# Altium project H2_transmitter_v2.PrjPcb
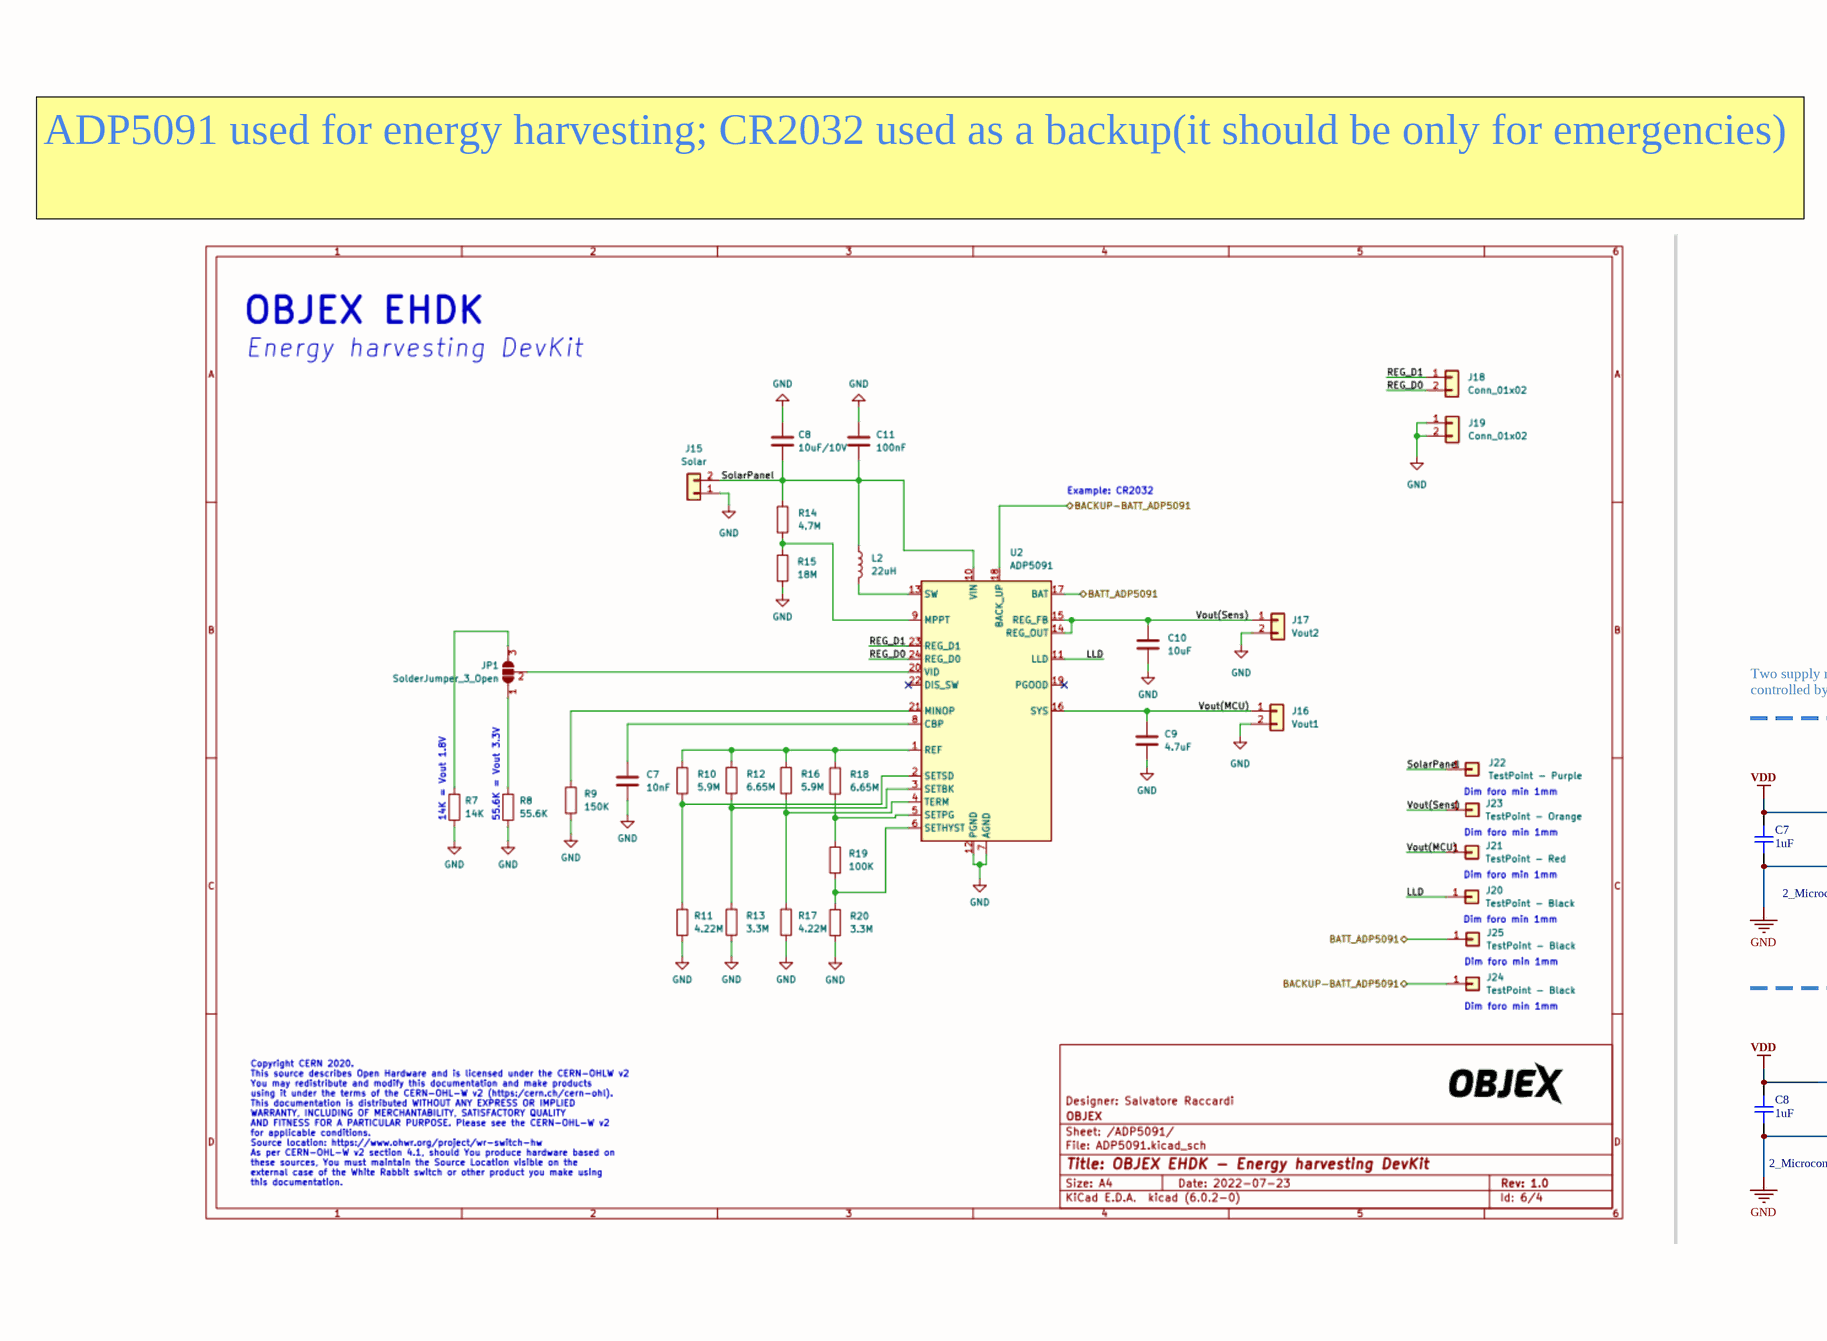
[diagram p0: 1_Power.SchDoc, left]
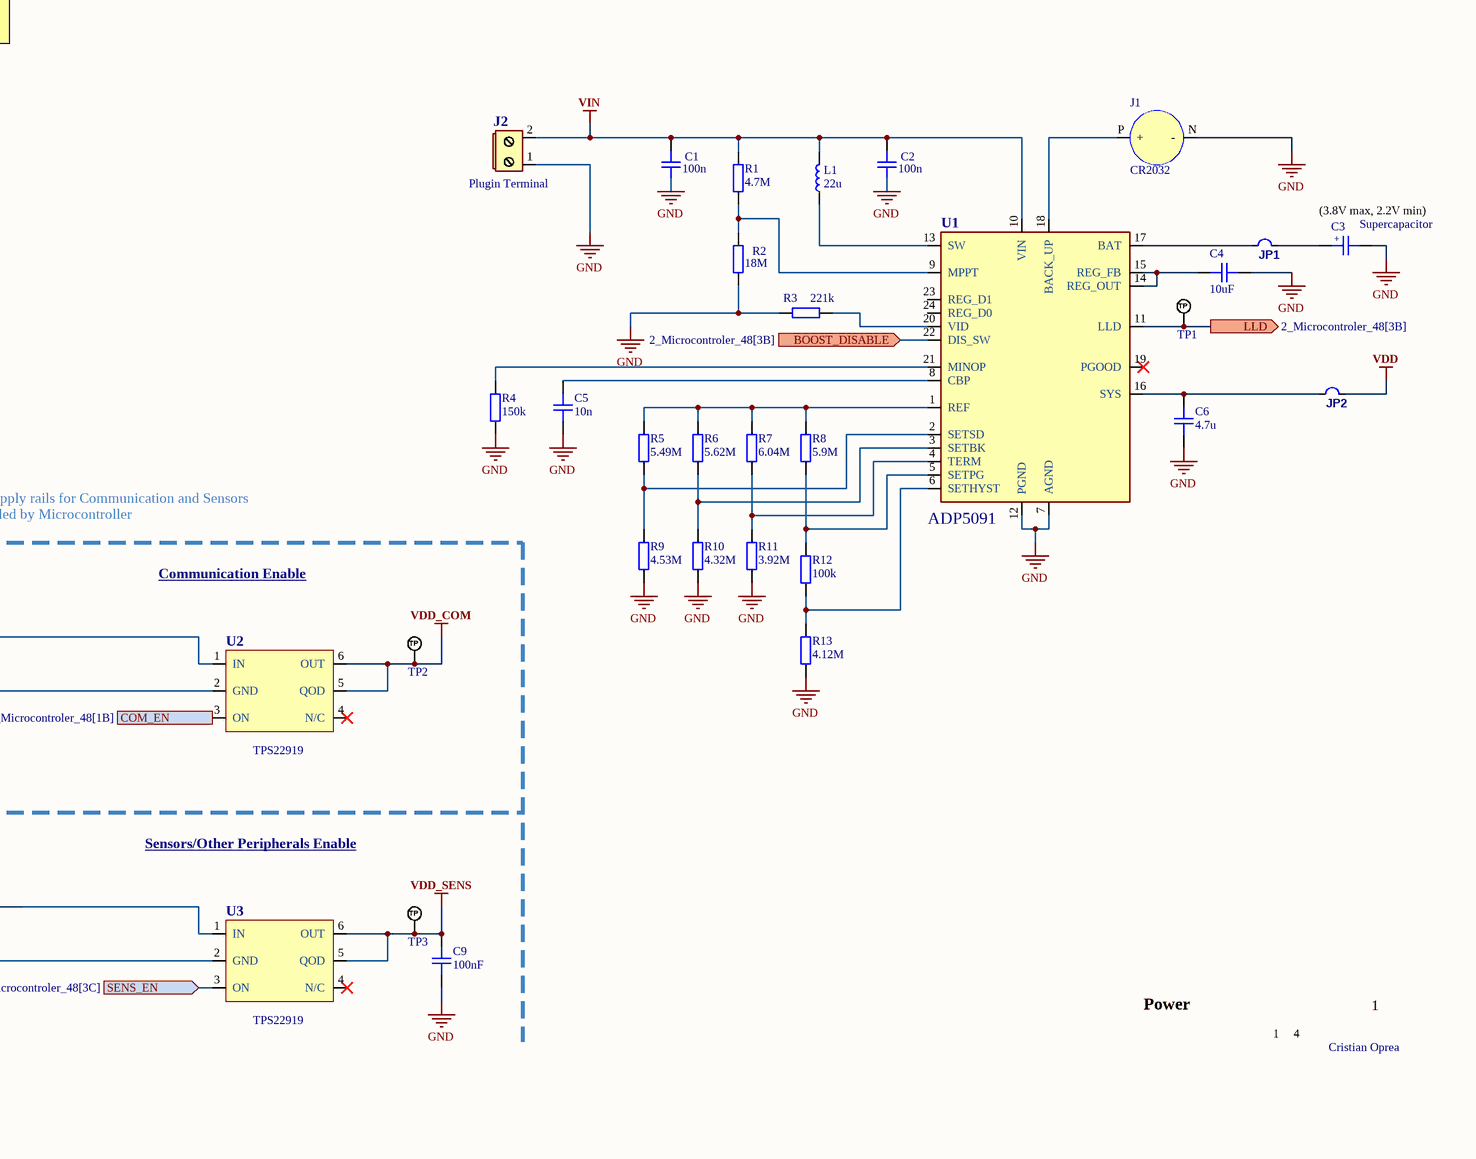
[diagram p1: 1_Power.SchDoc, middle]
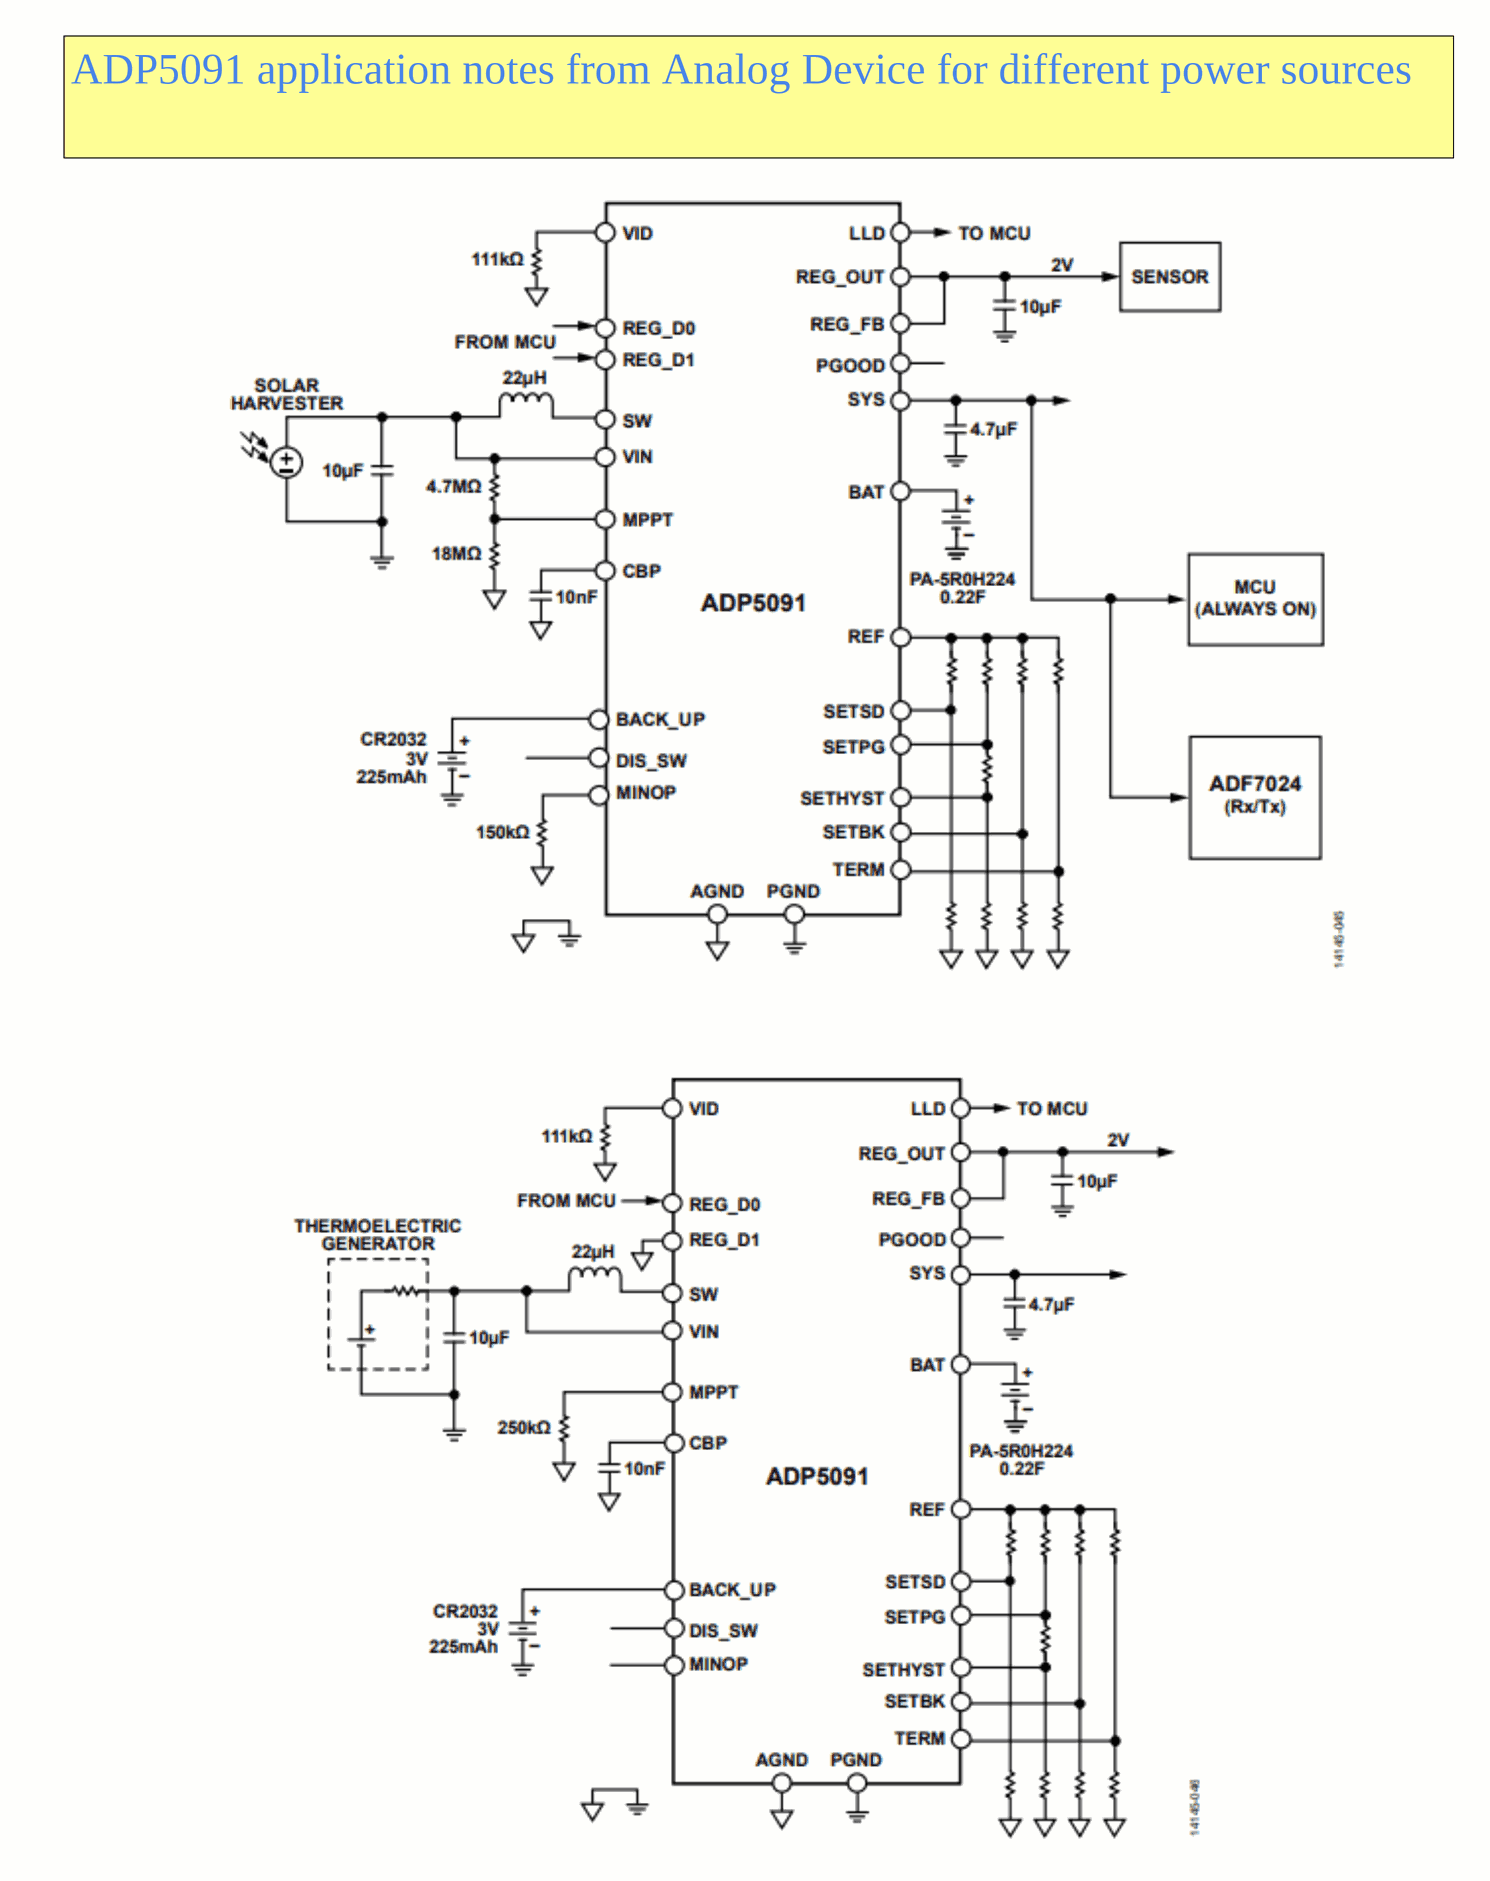
[diagram p2: 1_Power.SchDoc, right]
4 sheets, 85 parts. Net scope: flat (ports and power ports of the same name join across sheets).
Board file: PCB1.PcbDoc
Sheets:
  1_Power.SchDoc
  2_Microcontroler_48.SchDoc
  3_Communication.SchDoc
  4_Expansion.SchDoc

## Sheet 1_Power.SchDoc
size A4; SheetNumber: 1; SheetTotal: 4

### Parts
C1  100n  [C0603]
C2  100n  [C0603]
C3  Supercapacitor  [CAP_POL_8x16x3.5]
C4  10uF  [C0805]
C5  10n  [C0603]
C6  4.7u  [C0603]
C7  1uF  [C0603]
C8  1uF  [C0603]
C9  100nF  [C0603]
J1  CR2032  [BAT_CR2032-BS-6-1]
J2  Plugin Terminal  [2.54_pluggable_terminal]
JP1  JUMPER  [HEADER_1x2_2.54]  (value not drawn)
JP2  JUMPER  [HEADER_1x2_2.54]  (value not drawn)
L1  22u  [IND_3.2_4]
R1  4.7M  [R0603]
R2  18M  [R0603]
R3  221k  [R0603]
R4  150k  [R0603]
R5  5.49M  [R0603]
R6  5.62M  [R0603]
R7  6.04M  [R0603]
R8  5.9M  [R0603]
R9  4.53M  [R0603]
R10  4.32M  [R0603]
R11  3.92M  [R0603]
R12  100k  [R0603]
R13  4.12M  [R0603]
TP1  TP_NOBOM  [TEST_PAD_THD]  (value not drawn)  (no BOM)
TP2  TP_NOBOM  [TEST_PAD_THD]  (value not drawn)  (no BOM)
TP3  TP_NOBOM  [TEST_PAD_THD]  (value not drawn)  (no BOM)
U1  ADP5091  [LFCSP-24]
U2  TPS22919  [SC70-6]
U3  TPS22919  [SC70-6]

### Ports
BOOST_DISABLE (in, see 2_Microcontroler_48[3B]), COM_EN (in, see 2_Microcontroler_48[1B]), LLD (out, see 2_Microcontroler_48[3B]), SENS_EN (in, see 2_Microcontroler_48[3C])

### Nets
GND: C1.1 C2.1 C3.2 C4.2 C5.1 C6.1 C7.1 C8.1 C9.1 J1.N(-) J2.1 R2.1 R3.1 R4.1 R9.1 R10.1 R11.1 R13.1 U1.7(AGND) U1.12(PGND) U2.2(GND) U3.2(GND)
VDD: C7.2 C8.2 JP2.2 U2.1(IN) U3.1(IN)
VDD_COM: TP2.1(TP) U2.5(QOD) U2.6(OUT)
VDD_SENS: C9.2 TP3.1(TP) U3.5(QOD) U3.6(OUT)
VIN: C1.2 C2.2 J2.2 L1.2 R1.2 U1.10(VIN)
NetC3_1: C3.1 JP1.2
NetC4_1: C4.1 U1.14(REG_OUT) U1.15(REG_FB)
NetC5_2: C5.2 U1.8(CBP)
NetC6_2: C6.2 JP2.1 U1.16(SYS)
NetJ1_P: J1.P(+) U1.18(BACK_UP)
NetJP1_1: JP1.1 U1.17(BAT)
NetL1_1: L1.1 U1.13(SW)
NetR1_1: R1.1 R2.2 U1.9(MPPT)
NetR3_2: R3.2 U1.20(VID)
NetR4_2: R4.2 U1.21(MINOP)
NetR5_1: R5.1 R9.2 U1.2(SETSD)
NetR5_2: R5.2 R6.2 R7.2 R8.2 U1.1(REF)
NetR6_1: R6.1 R10.2 U1.3(SETBK)
NetR7_1: R7.1 R11.2 U1.4(TERM)
NetR8_1: R8.1 R12.2 U1.5(SETPG)
NetR12_1: R12.1 R13.2 U1.6(SETHYST)
NetTP1_1: TP1.1(TP) U1.11(LLD) ; port LLD
NetTP4_1: U1.22(DIS_SW) ; port BOOST_DISABLE
NetTP6_1: U2.3(ON) ; port COM_EN
NetTP7_1: U3.3(ON) ; port SENS_EN

Not connected (* = marked no-connect by the designer): U1 19(PGOOD)* 23(REG_D1) 24(REG_D0); U2 4(N/C)*; U3 4(N/C)*

### Notes on the sheet
- ADP5091 application notes from Analog Device for different power sources
- ADP5091 used for energy harvesting; CR2032 used as a backup(it should be only for emergencies)
- (near J2) 0.5V to 3.3V input
- R1 not populated for TEG generators
- (near C3) (3.8V max, 2.2V min)
- VID resistor for setting output voltage
- Low Light Density (low voltage at input), PGOOD is HIGH only when output voltage is higher than the set voltage
- Two supply rails for Communication and Sensors controlled by Microcontroller
- Vsetbk = 2.3V (backup supply swith on threshold)(higher than stop discharge threshold)
- (near R11) Vbat_term = 3.8V (stop charge threshold) (hybrid supercapacitor with lithium)
- Communication Enable
- Vsetsd = 2.2V (stop discharge threshold) (hybrid supercapacitor with lithium)
- Vsetbkhys = (hysteresis threshold)
- (near JP2) Floating: VOUT = 2.5 V
  RVID = 7 kΩ: VOUT = 1.5 V
  RVID = 14 kΩ: VOUT = 1.8 V
  RVID = 27.7 kΩ: VOUT = 3.6 V
  RVID = 55.6 kΩ:VOUT = 3.3 V
  RVID = 111 kΩ: VOUT = 2.0 V
  RVID = 221 kΩ: VOUT = 3.0 V
  RVID = 442 kΩ: VOUT = 2.8 V
- (near R13) Vsetpg = 2.4V (power good threshold) (voltage output is higher than this threshold)
- Sensors/Other Peripherals Enable
- Power
- 1
- 4
- Cristian Oprea
- (in symbol Supercapacitor) +

### Library data of the parts
C1 C2 C5-C9 = CAP_0603: Capacitor SMD 0603; Manufacturer: *; Manufacturer Part Number: *; Distributor Link: *; LCSC: *; Rating: *; Dielectric: *
C4 = CAP_0805: Capacitor SMD 0805; Manufacturer: *; Manufacturer Part Number: *; Distributor Link: *; LCSC: *; Rating: *; Dielectric: *
J1 = CR2032-BS-6-1: CR2032 Coin Cell Battery Holder; Manufacturer: Q&J; Manufacturer Part Number: CR2032-BS-6-1
J2 = Power_Connector: Screw terminal or plug terminal for power
JP1 JP2 = JUMPER: *; PackageReference: *; Manufacturer Part Number 1: *
L1 = IND_1008: Inductor SMD 1008
R1-R13 = RES_0603: Resistor SMD 0603; Manufacturer: *; Manufacturer Part Number: *; Distributor Link: *; LCSC: *
TP1-TP3 = TEST_POINT_RND_1MM: Test Point Round 1mm (NO BOM)
U1 = ADP5091: Ultralow Power Energy Harvester PMUs / with MPPT and Charge Management and BAckup Supply
U2 U3 = TPS22919: 5.5-V, 1.5-A, 90-mΩ load switch with adjustable output discharge
C3 = Supercapacitor: Manufacturer: *; Manufacturer Part Number: *; Distributor Link: *; LCSC: *

## Sheet 2_Microcontroler_48.SchDoc
size A4; SheetNumber: 2; SheetTotal: 4
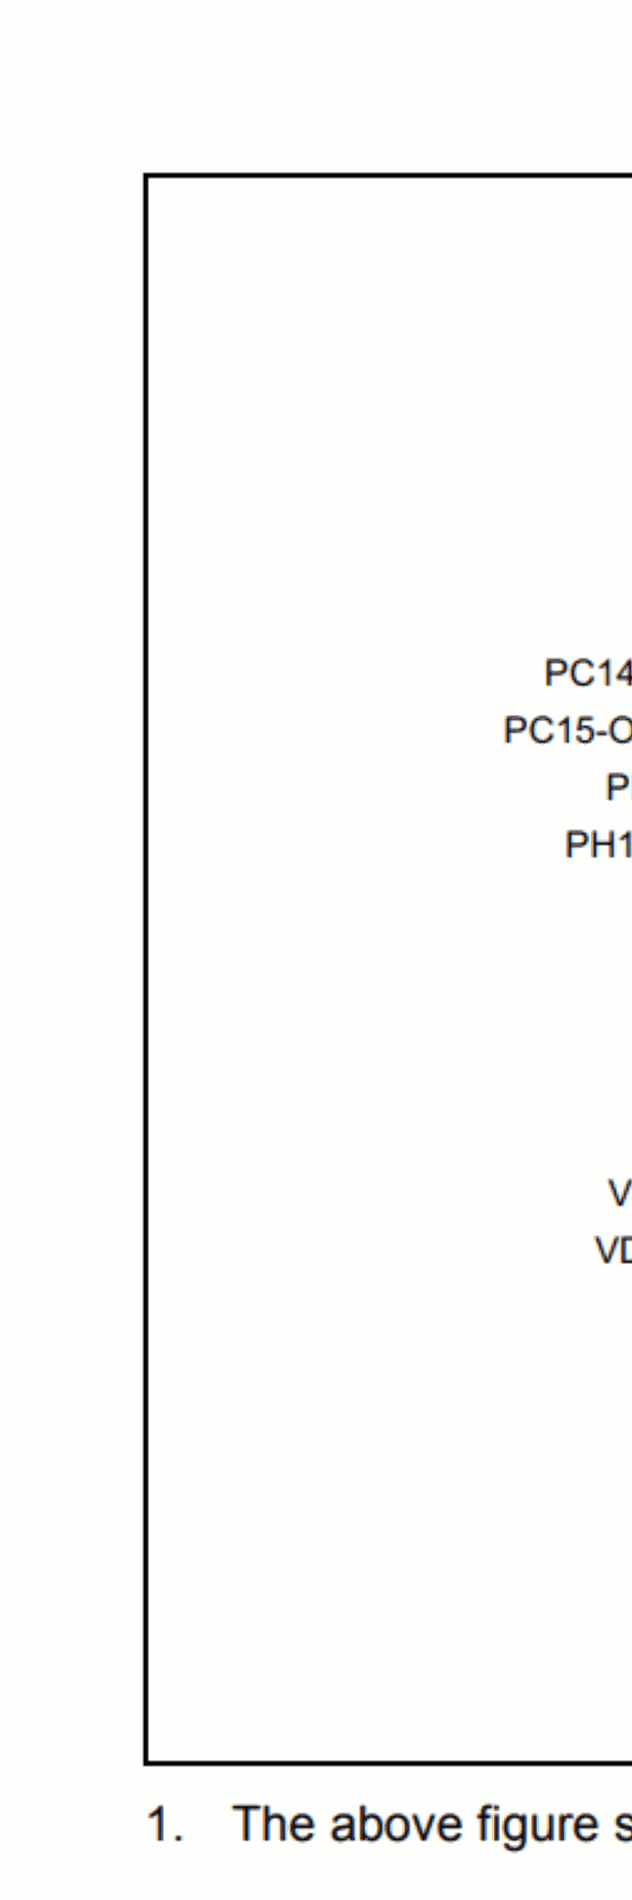
[diagram p3: 2_Microcontroler_48.SchDoc, top left]
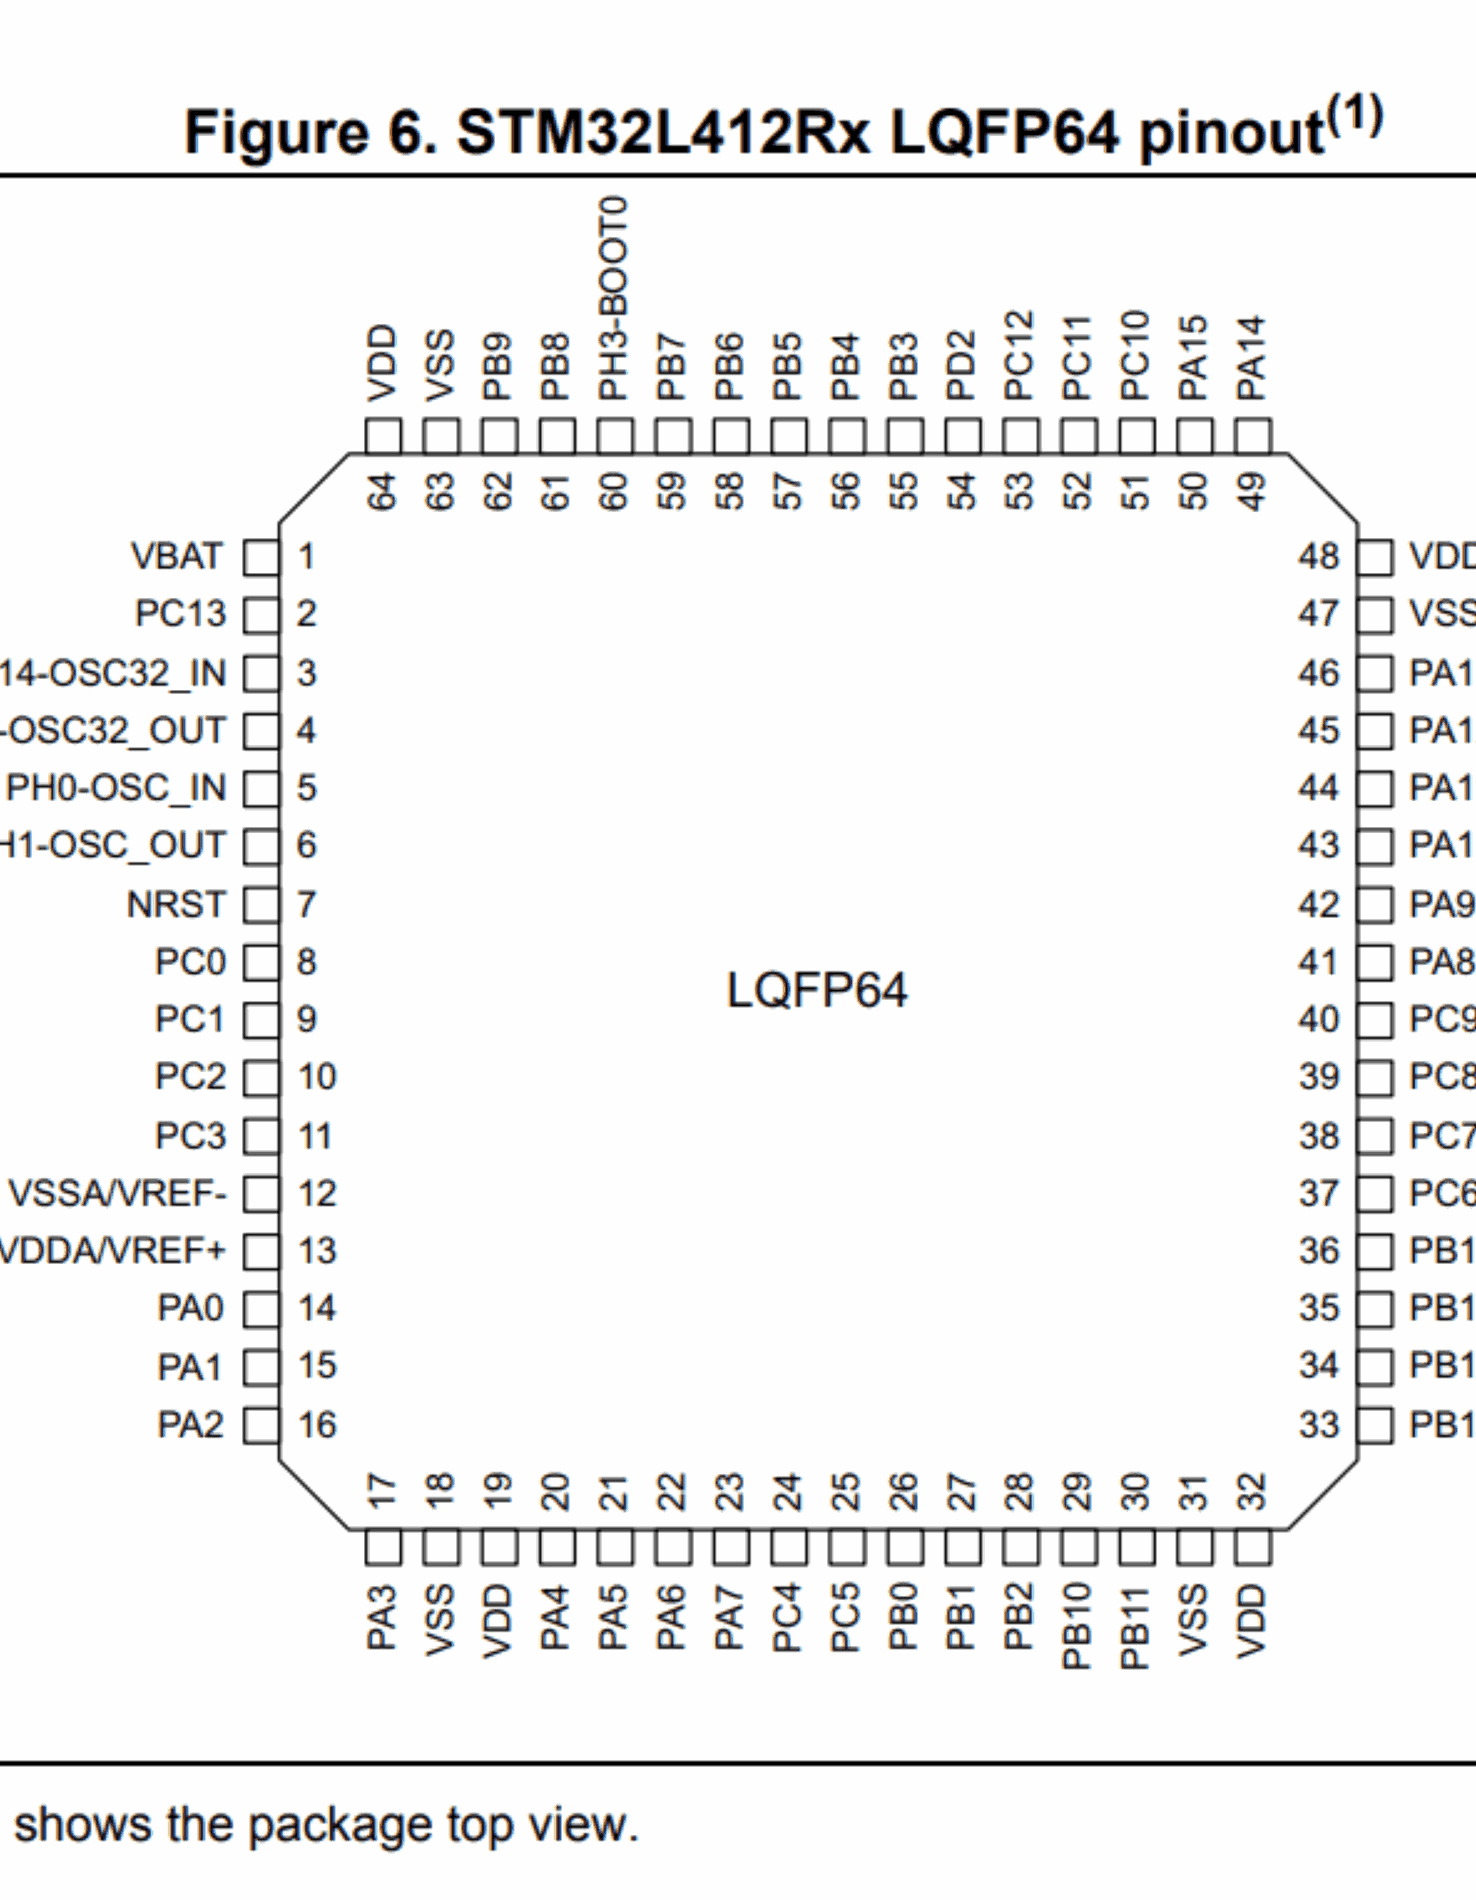
[diagram p4: 2_Microcontroler_48.SchDoc, top middle]
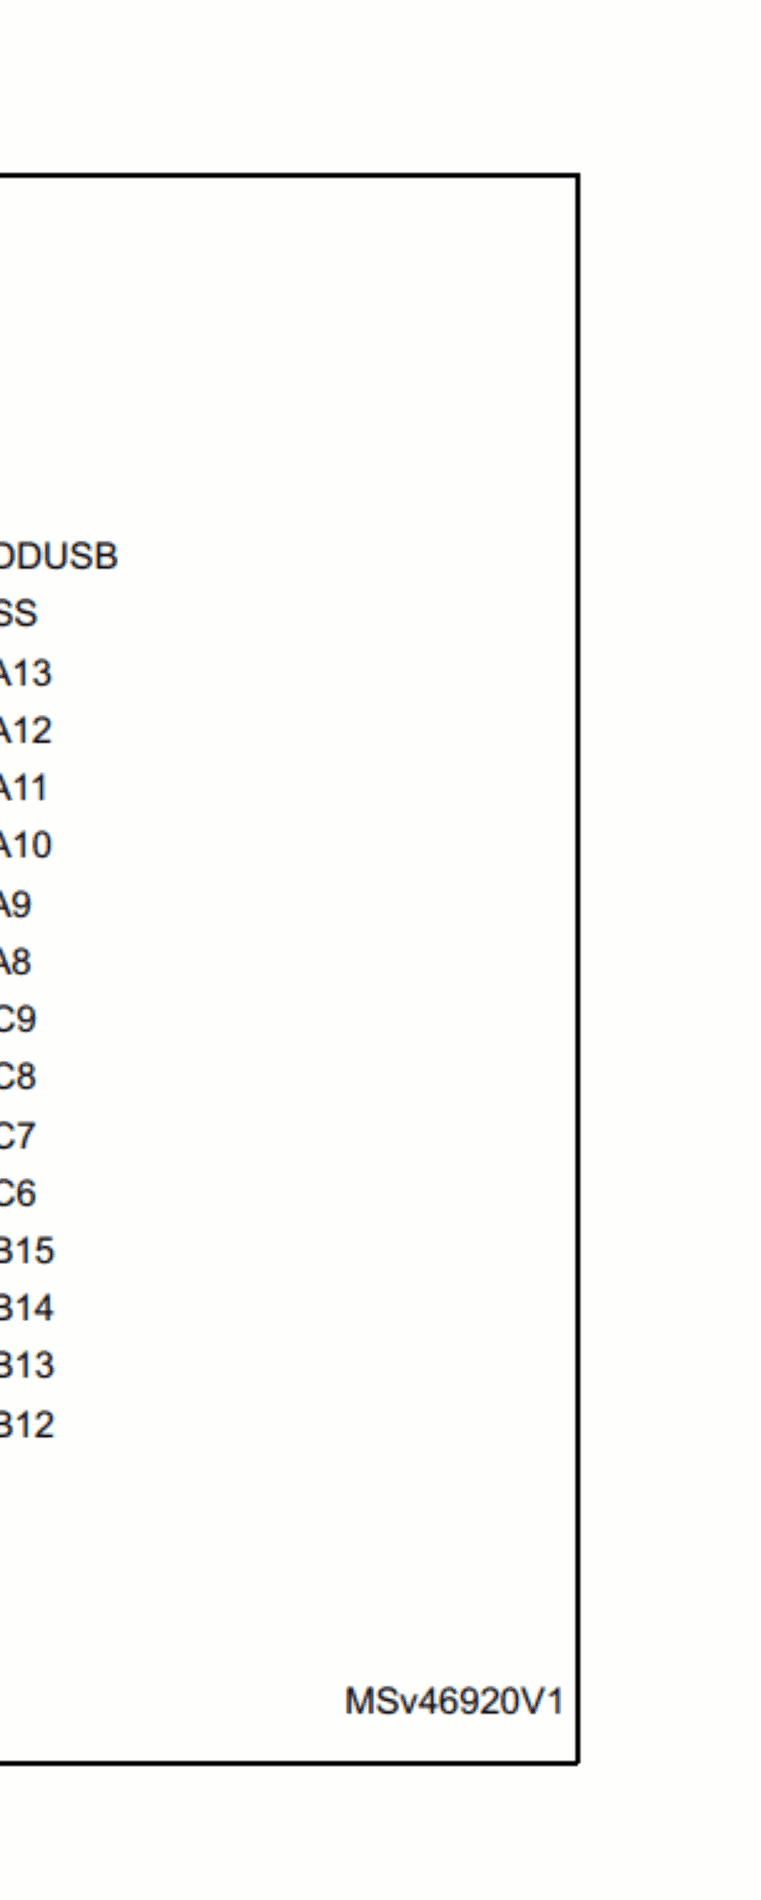
[diagram p5: 2_Microcontroler_48.SchDoc, top right]
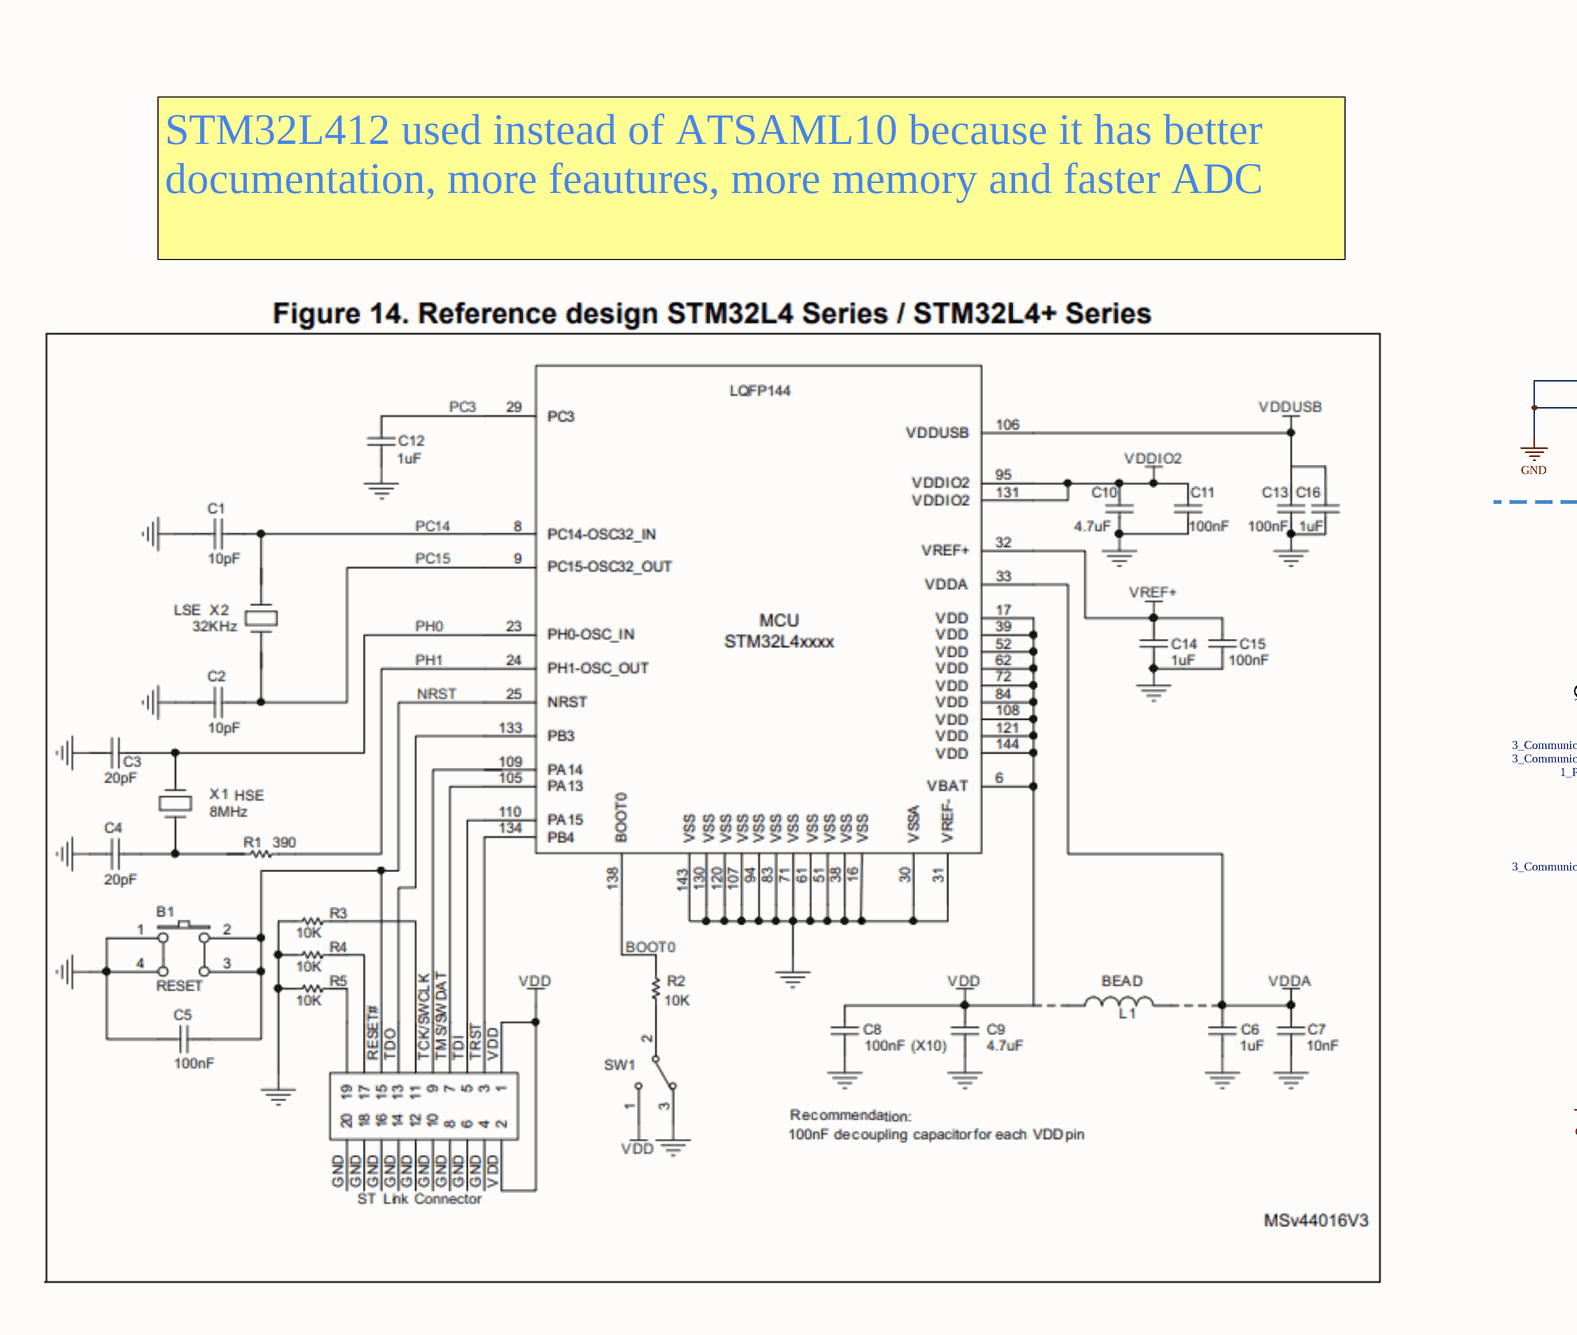
[diagram p6: 2_Microcontroler_48.SchDoc, bottom left]
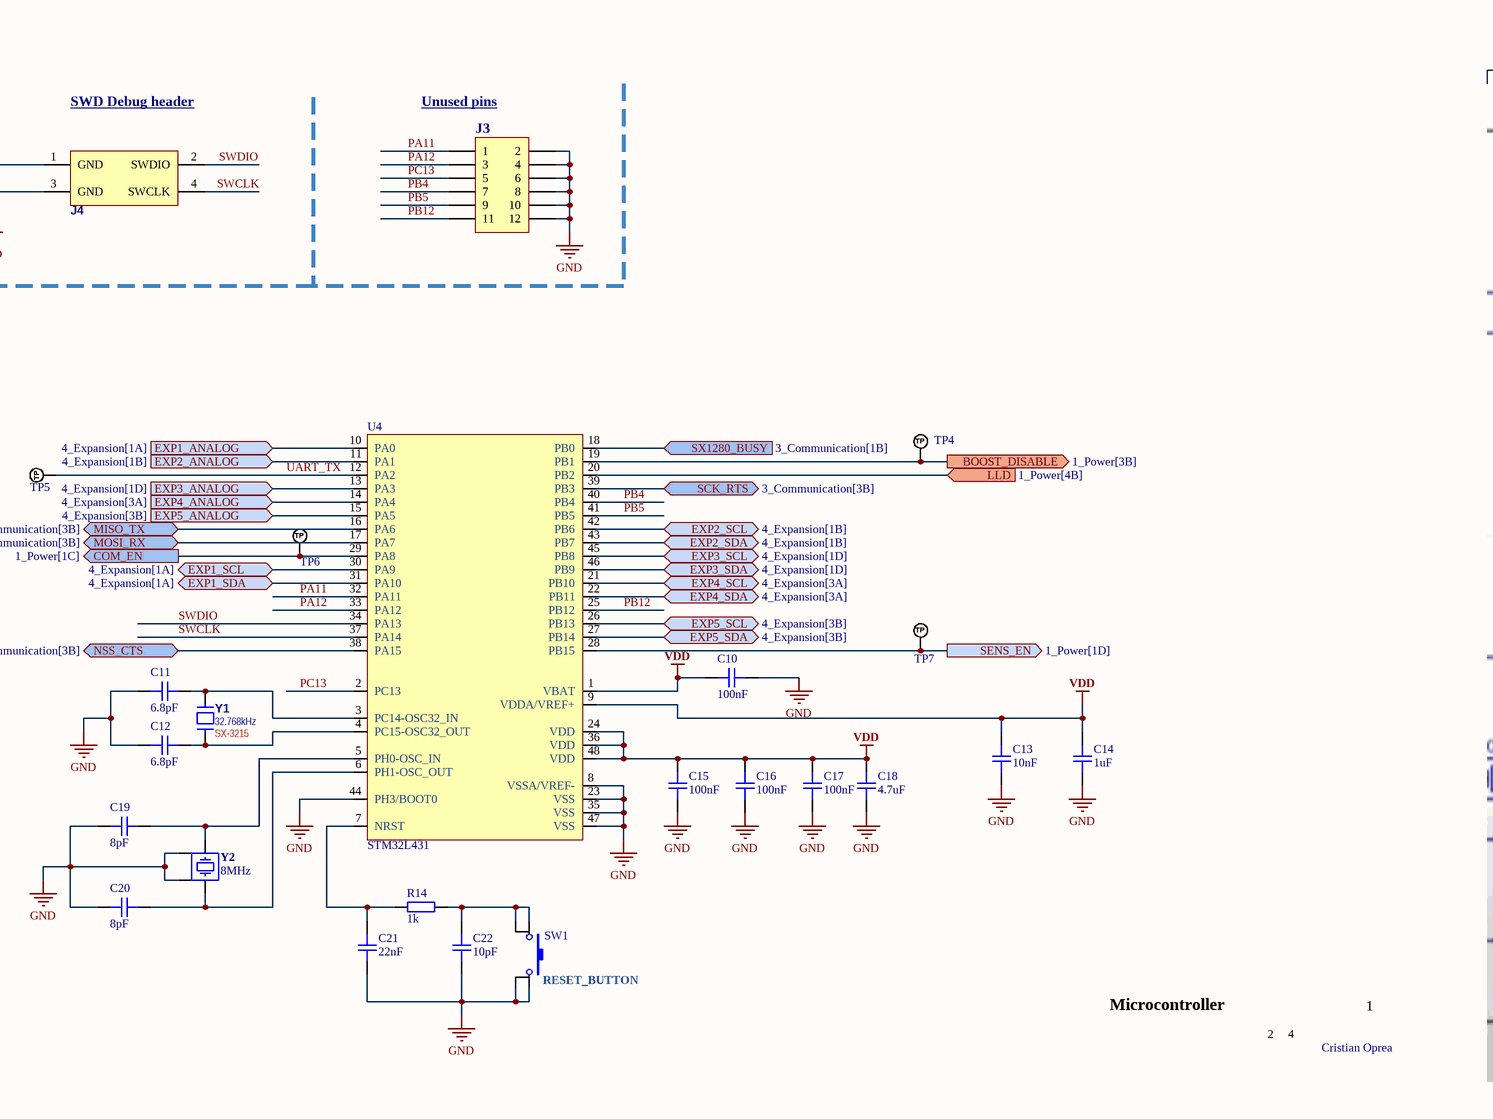
[diagram p7: 2_Microcontroler_48.SchDoc, bottom middle]
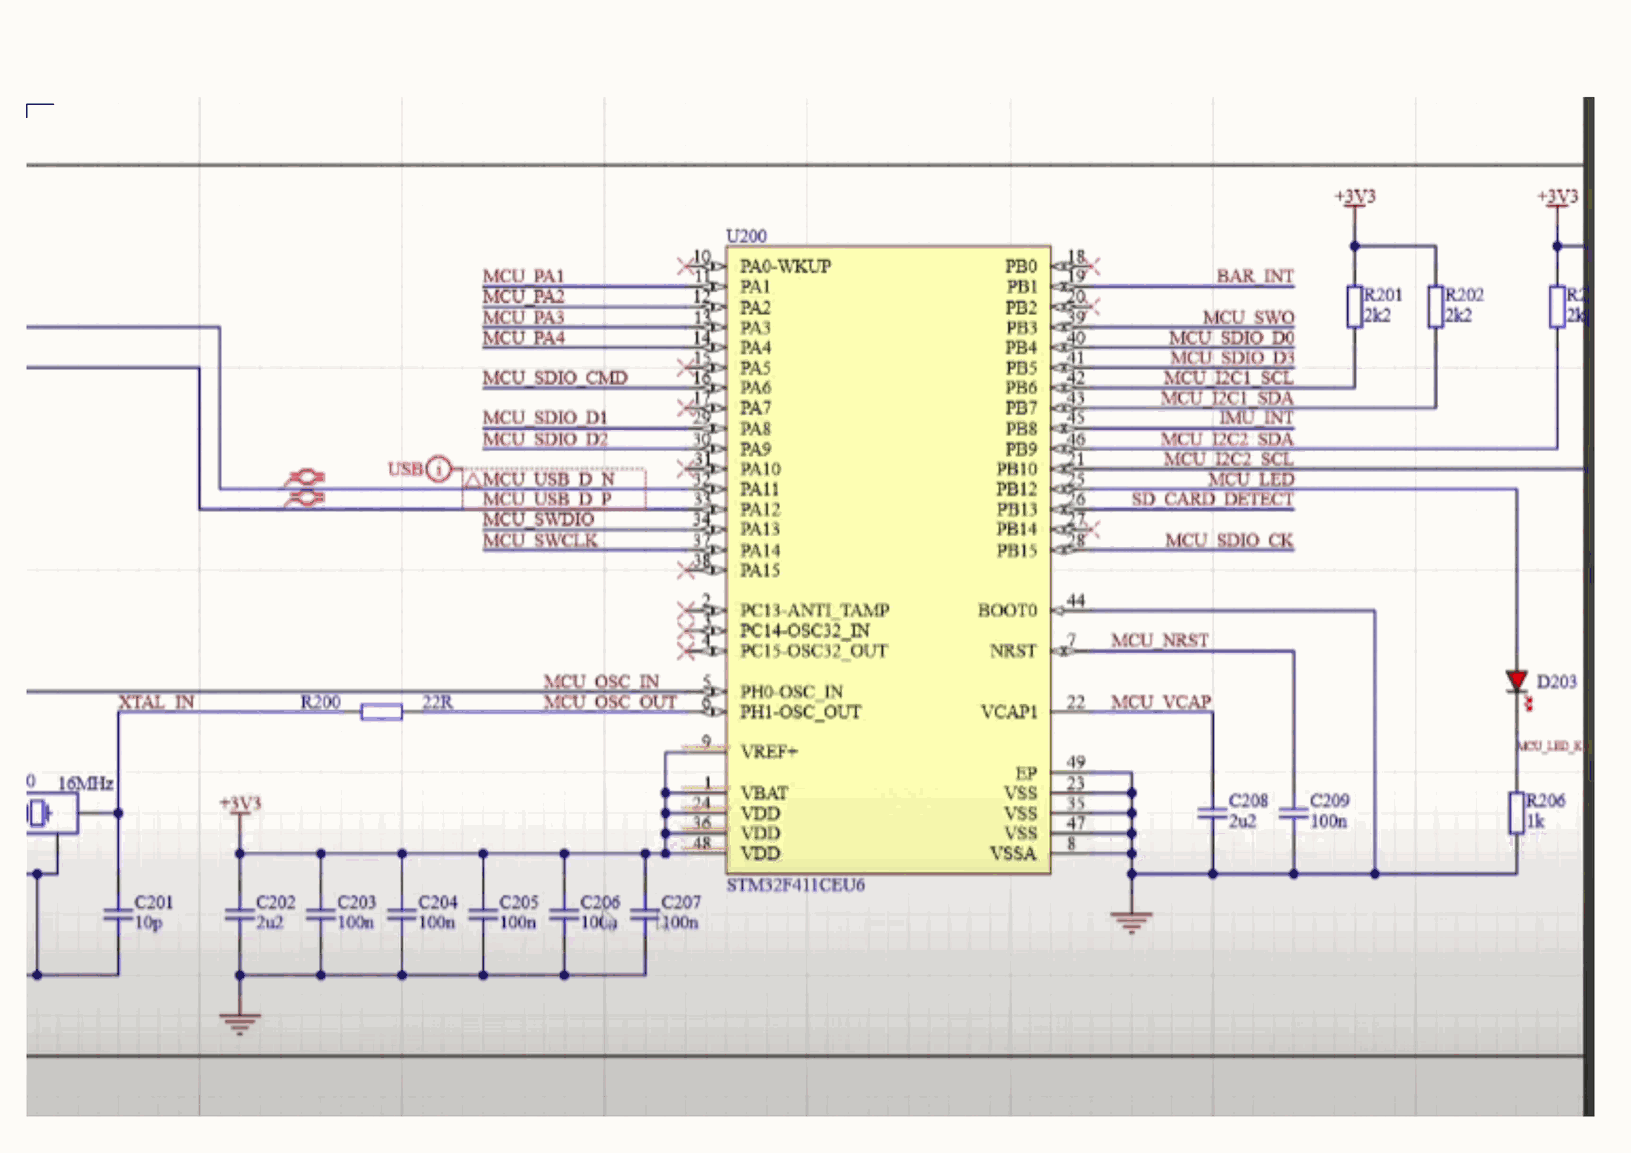
[diagram p8: 2_Microcontroler_48.SchDoc, bottom right]

### Parts
C10  100nF  [C0603]
C11  6.8pF  [C0603]
C12  6.8pF  [C0603]
C13  10nF  [C0603]
C14  1uF  [C0603]
C15  100nF  [C0603]
C16  100nF  [C0603]
C17  100nF  [C0603]
C18  4.7uF  [C0603]
C19  8pF  [C0603]
C20  8pF  [C0603]
C21  22nF  [C0603]
C22  10pF  [C0603]
J3  Header 6X2  [HEADER_6x2_2.54]  (value not drawn)
J4  SWD connector  [HEADER_2x2_2.54]  (value not drawn)
R14  1k  [R0603]
SW1  PTS645SM43SMTR92 LFS  [SW_SKRPACE010]  (value not drawn)
TP4  TP_NOBOM  [TEST_PAD_THD]  (value not drawn)  (no BOM)
TP5  TP_NOBOM  [TEST_PAD_THD]  (value not drawn)  (no BOM)
TP6  TP_NOBOM  [TEST_PAD_THD]  (value not drawn)  (no BOM)
TP7  TP_NOBOM  [TEST_PAD_THD]  (value not drawn)  (no BOM)
U4  STM32L431  [QFPN-48]
Y1  32.768kHz  PackageReference: SX-3215  [CRYSTAL_SX-3215]
Y2  8MHz  [CRYSTAL_ECX-32_3.2x2.5x0.8 - duplicate]

### Ports
BOOST_DISABLE (out, see 1_Power[3B]), COM_EN (out, see 1_Power[1C]), EXP1_ANALOG (in, see 4_Expansion[1A]), EXP1_SCL (bidir, see 4_Expansion[1A]), EXP1_SDA (bidir, see 4_Expansion[1A]), EXP2_ANALOG (in, see 4_Expansion[1B]), EXP2_SCL (bidir, see 4_Expansion[1B]), EXP2_SDA (bidir, see 4_Expansion[1B]), EXP3_ANALOG (in, see 4_Expansion[1D]), EXP3_SCL (bidir, see 4_Expansion[1D]), EXP3_SDA (bidir, see 4_Expansion[1D]), EXP4_ANALOG (in, see 4_Expansion[3A]), EXP4_SCL (bidir, see 4_Expansion[3A]), EXP4_SDA (bidir, see 4_Expansion[3A]), EXP5_ANALOG (in, see 4_Expansion[3B]), EXP5_SCL (bidir, see 4_Expansion[3B]), EXP5_SDA (bidir, see 4_Expansion[3B]), LLD (in, see 1_Power[4B]), MISO_TX (bidir, see 3_Communication[3B]), MOSI_RX (bidir, see 3_Communication[3B]), NSS_CTS (bidir, see 3_Communication[3B]), SCK_RTS (bidir, see 3_Communication[3B]), SENS_EN (out, see 1_Power[1D]), SX1280_BUSY (in, see 3_Communication[1B])

### Nets
GND: C10.1 C11.1 C12.1 C13.1 C14.1 C15.1 C16.1 C17.1 C18.1 C19.1 C20.1 C21.1 C22.1 J3.2 J3.4 J3.6 J3.8 J3.10 J3.12 J4.1(GND) J4.3(GND) SW1.3 SW1.4 U4.8(VSSA/VREF-) U4.23(VSS) U4.35(VSS) U4.44(PH3/BOOT0) U4.47(VSS) Y2.2 Y2.4
VDD: C10.2 C13.2 C14.2 C15.2 C16.2 C17.2 C18.2 U4.1(VBAT) U4.9(VDDA/VREF+) U4.24(VDD) U4.36(VDD) U4.48(VDD)
PA11: J3.1 U4.32(PA11)
PA12: J3.3 U4.33(PA12)
PB4: J3.7 U4.40(PB4)
PB5: J3.9 U4.41(PB5)
PB12: J3.11 U4.25(PB12)
PC13: J3.5 U4.2(PC13)
SWCLK: J4.4(SWCLK) U4.37(PA14)
SWDIO: J4.2(SWDIO) U4.34(PA13)
UART_TX: TP5.1(TP) U4.12(PA2)
NetC11_2: C11.2 U4.3(PC14-OSC32_IN) Y1.2
NetC12_2: C12.2 U4.4(PC15-OSC32_OUT) Y1.1
NetC19_2: C19.2 U4.5(PH0-OSC_IN) Y2.3
NetC20_2: C20.2 U4.6(PH1-OSC_OUT) Y2.1
NetC21_2: C21.2 R14.1 U4.7(NRST)
NetC22_2: C22.2 R14.2 SW1.1 SW1.2
NetJ6_1: U4.14(PA4) ; port EXP4_ANALOG
NetJ6_2: U4.21(PB10) ; port EXP4_SCL
NetJ6_3: U4.22(PB11) ; port EXP4_SDA
NetJ7_1: U4.10(PA0) ; port EXP1_ANALOG
NetJ7_2: U4.30(PA9) ; port EXP1_SCL
NetJ7_3: U4.31(PA10) ; port EXP1_SDA
NetJ8_1: U4.11(PA1) ; port EXP2_ANALOG
NetJ8_2: U4.42(PB6) ; port EXP2_SCL
NetJ8_3: U4.43(PB7) ; port EXP2_SDA
NetJ9_1: U4.15(PA5) ; port EXP5_ANALOG
NetJ9_2: U4.26(PB13) ; port EXP5_SCL
NetJ9_3: U4.27(PB14) ; port EXP5_SDA
NetJ10_1: U4.13(PA3) ; port EXP3_ANALOG
NetJ10_2: U4.45(PB8) ; port EXP3_SCL
NetJ10_3: U4.46(PB9) ; port EXP3_SDA
NetTP1_1: U4.20(PB2) ; port LLD
NetTP4_1: TP4.1(TP) U4.19(PB1) ; port BOOST_DISABLE
NetTP6_1: TP6.1(TP) U4.29(PA8) ; port COM_EN
NetTP7_1: TP7.1(TP) U4.28(PB15) ; port SENS_EN
NetTP8_1: U4.38(PA15) ; port NSS_CTS
NetTP9_1: U4.39(PB3) ; port SCK_RTS
NetTP10_1: U4.17(PA7) ; port MOSI_RX
NetTP11_1: U4.18(PB0) ; port SX1280_BUSY
NetTP12_1: U4.16(PA6) ; port MISO_TX

### Notes on the sheet
- STM32L412 used instead of ATSAML10 because it has better documentation, more feautures, more memory and faster ADC
- SWD Debug header
- (near J3) Unused pins
- (near SW1) RESET_BUTTON
- Microcontroller
- 2
- 4
- 1
- Cristian Oprea

### Library data of the parts
C10-C22 = CAP_0603: Capacitor SMD 0603; Manufacturer: *; Manufacturer Part Number: *; Distributor Link: *; LCSC: *; Rating: *; Dielectric: *
J3 = Header 6x2: Header, 12-Pin, Dual row; LatestRevisionDate: 17-Jul-2002; LatestRevisionNote: Re-released for DXP Platform.; Publisher: Altium Limited
J4 = SWD connector: Single Wire Debug connector with UART _TX pin; PackageReference: *; Manufacturer Part Number 1: *
R14 = RES_0603: Resistor SMD 0603; Manufacturer: *; Manufacturer Part Number: *; Distributor Link: *; LCSC: *
SW1 = SW-PB: Switch; Published: 24-Mar-1999; LatestRevisionDate: 17-Jul-2002; LatestRevisionNote: Re-released for DXP Platform.; Publisher: Altium Limited; PackageDescription: Switch; 2 Leads; Manufacturer Part Number 1: PTS645SM43SMTR92 LFS; PackageReference: SW-PB
TP4-TP7 = TEST_POINT_RND_1MM: Test Point Round 1mm (NO BOM)
U4 = STM32L431: Ultra-low-power Arm® Cortex®-M4 32-bit MCU+FPU, 100DMIPS, / up to 128KB flash, 40KB SRAM(LQFP48)
Y1 = CRYSTAL_1: Crystal; Manufacturer Part Number 1: *
Y2 = Crystal: Manufacturer: Epson; Manufacturer Part Number: TSX-3225 24.0000MF15X-AC

## Sheet 3_Communication.SchDoc
size A4; SheetNumber: 3; SheetTotal: 4
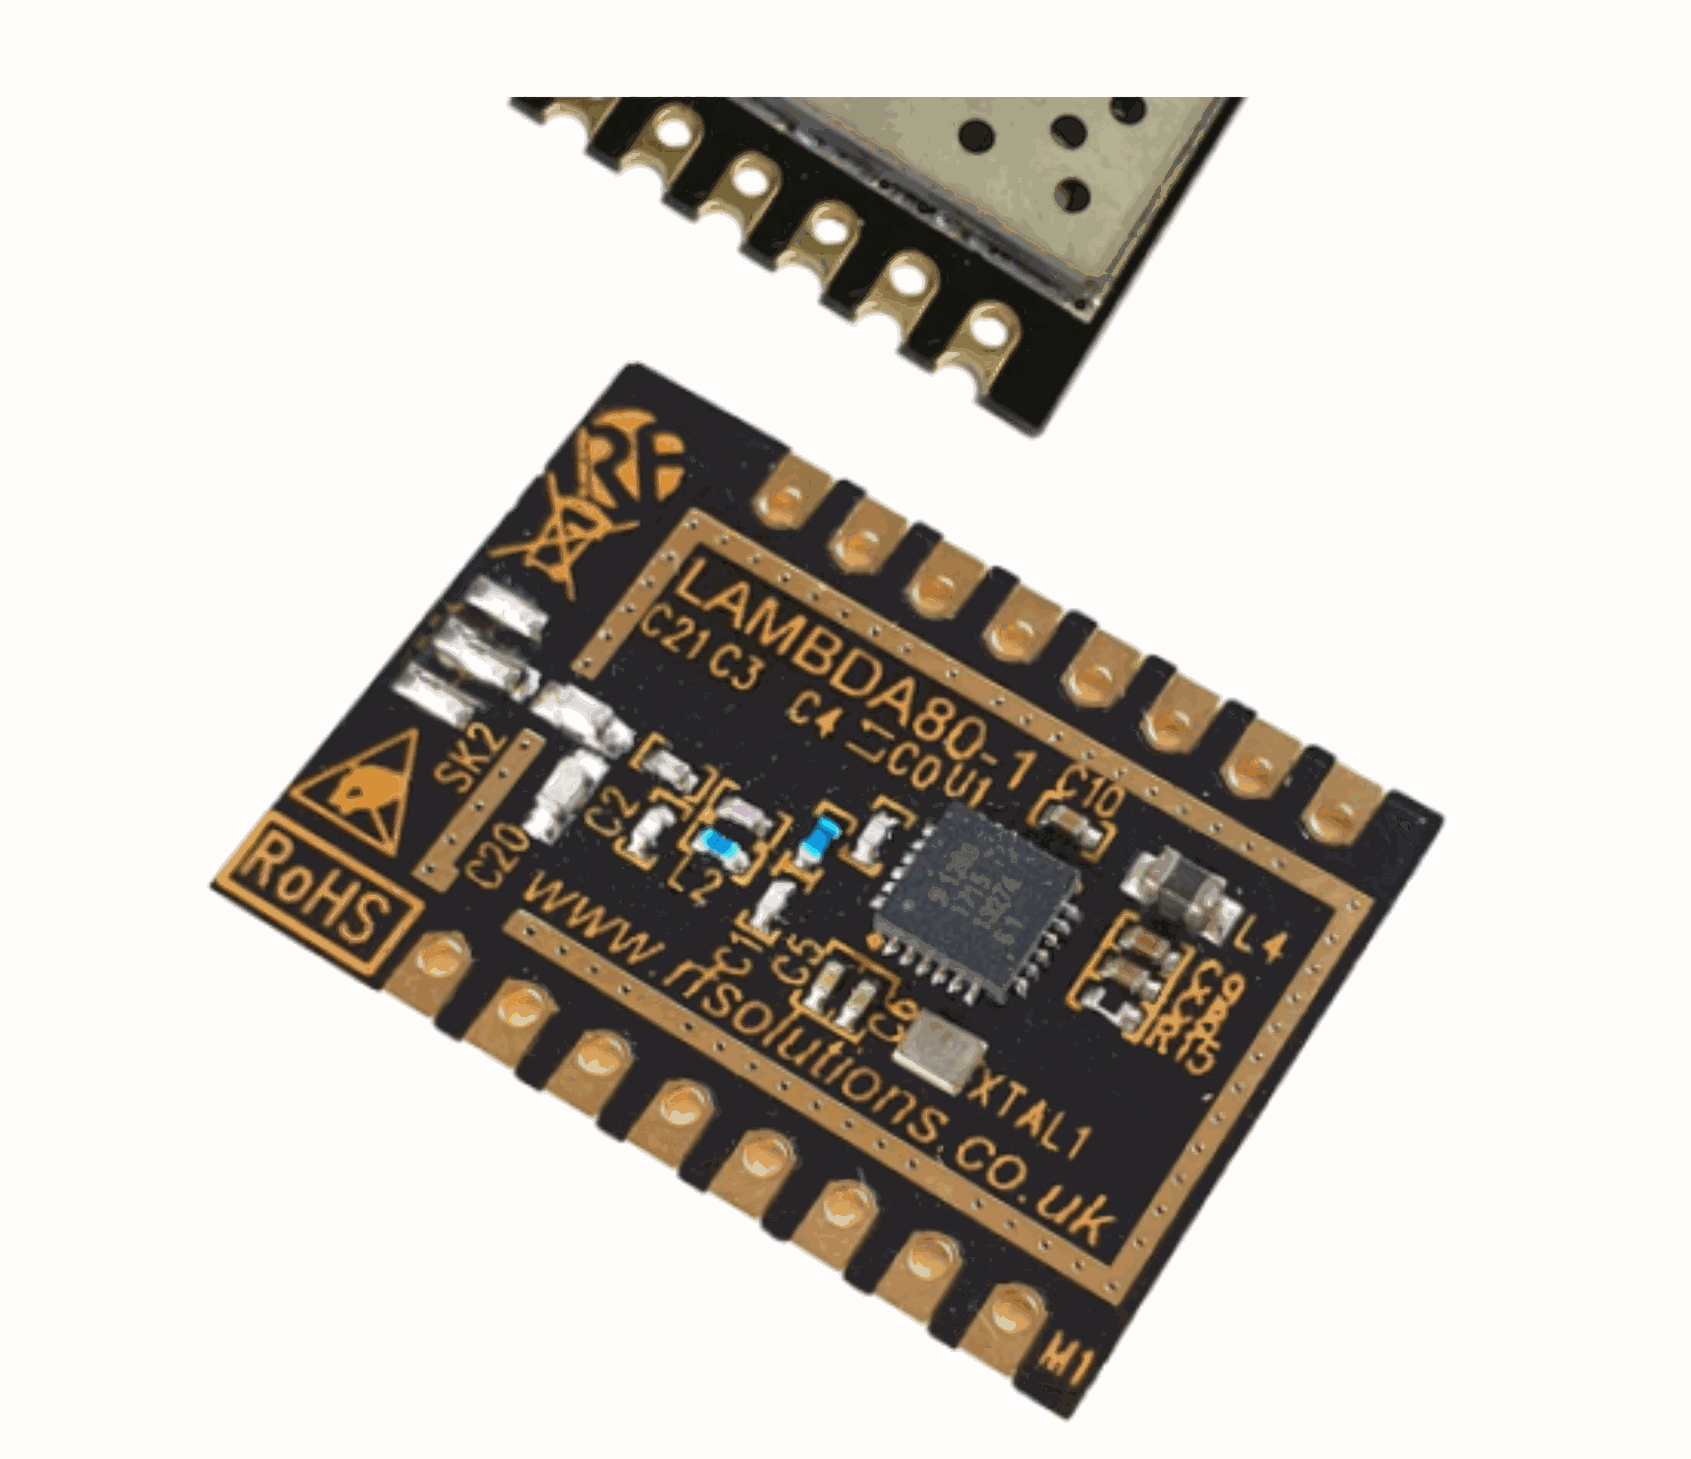
[diagram p9: 3_Communication.SchDoc, top middle]
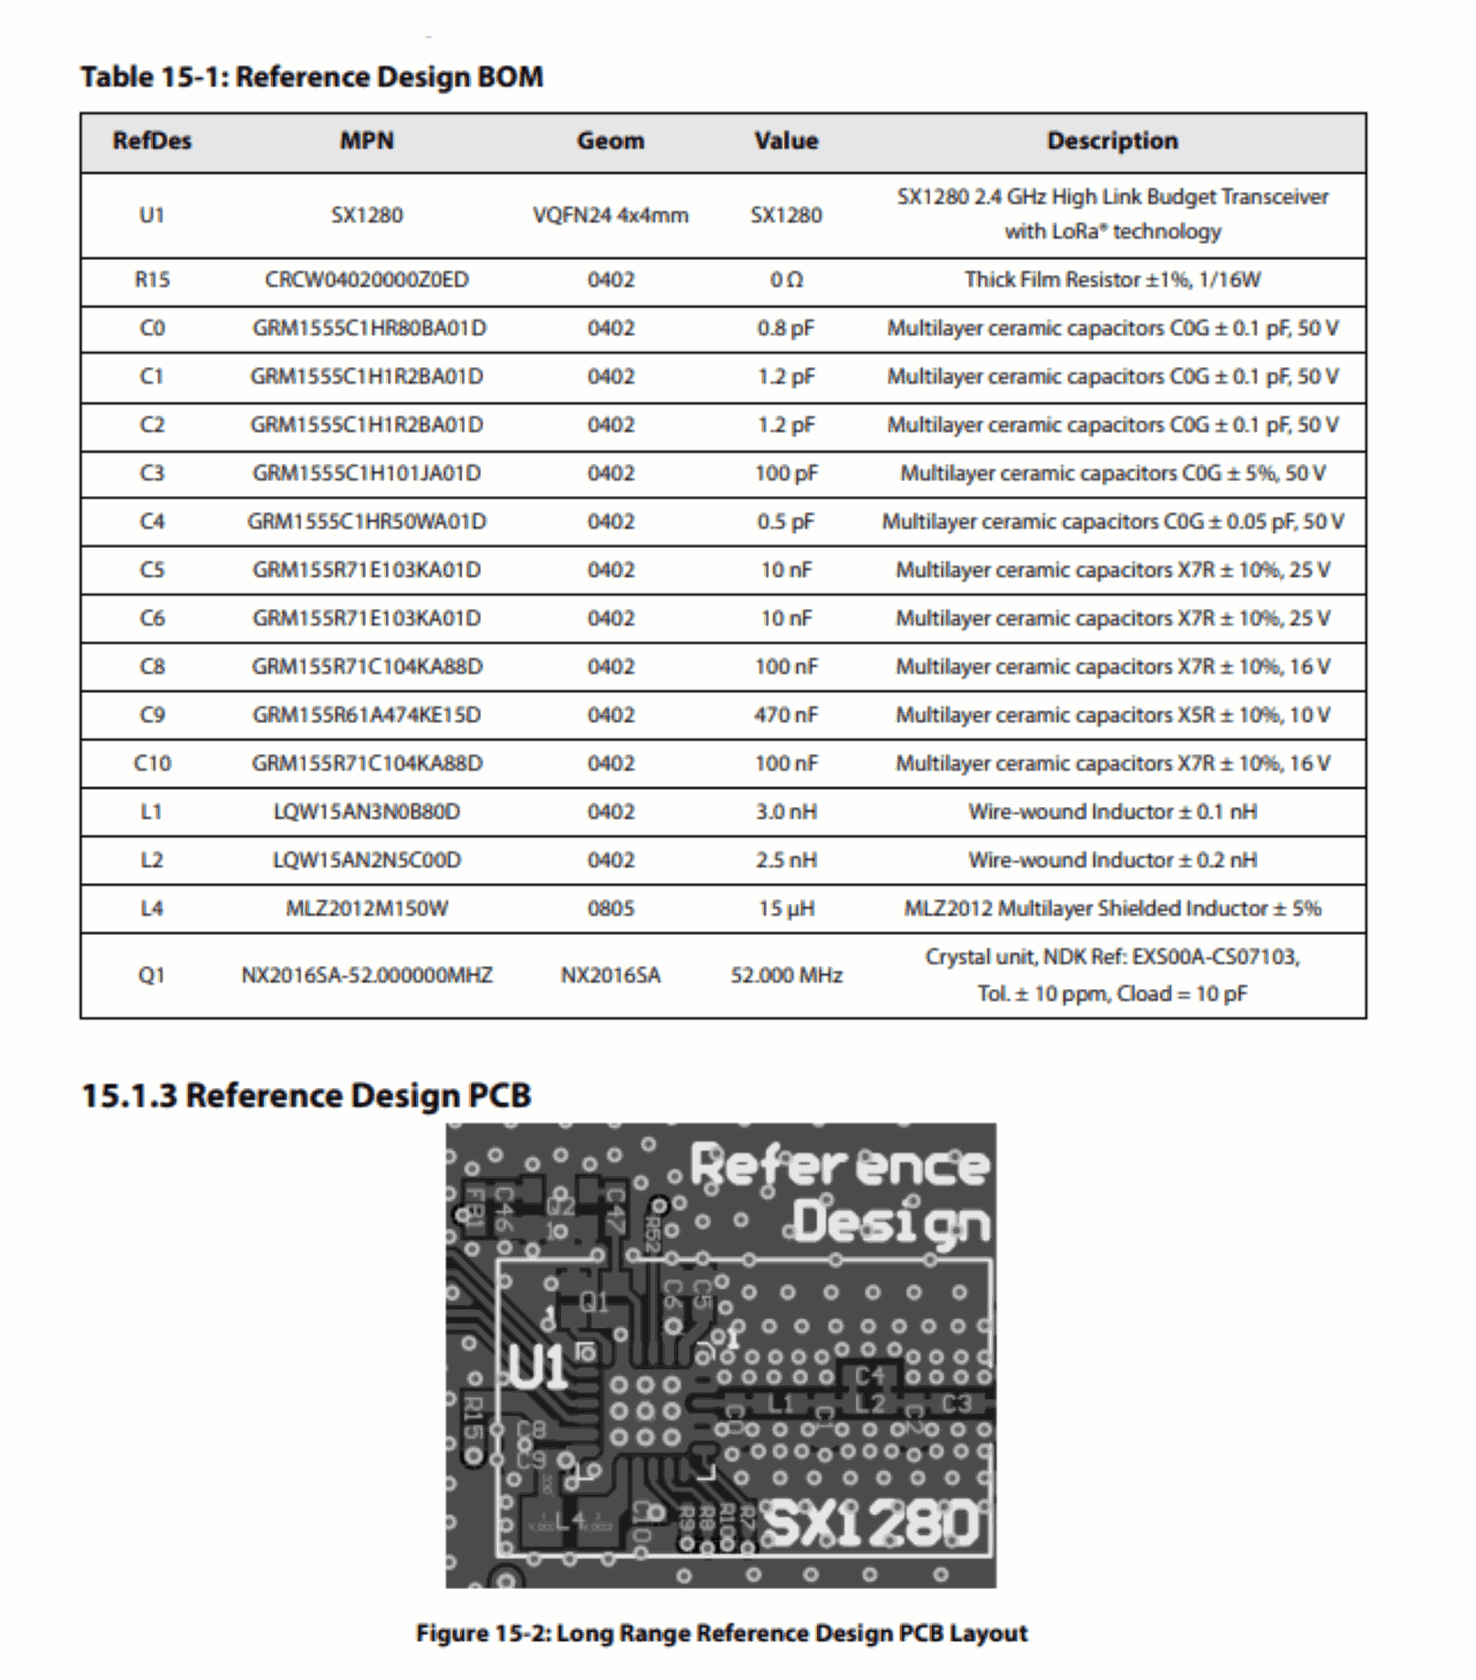
[diagram p10: 3_Communication.SchDoc, top right]
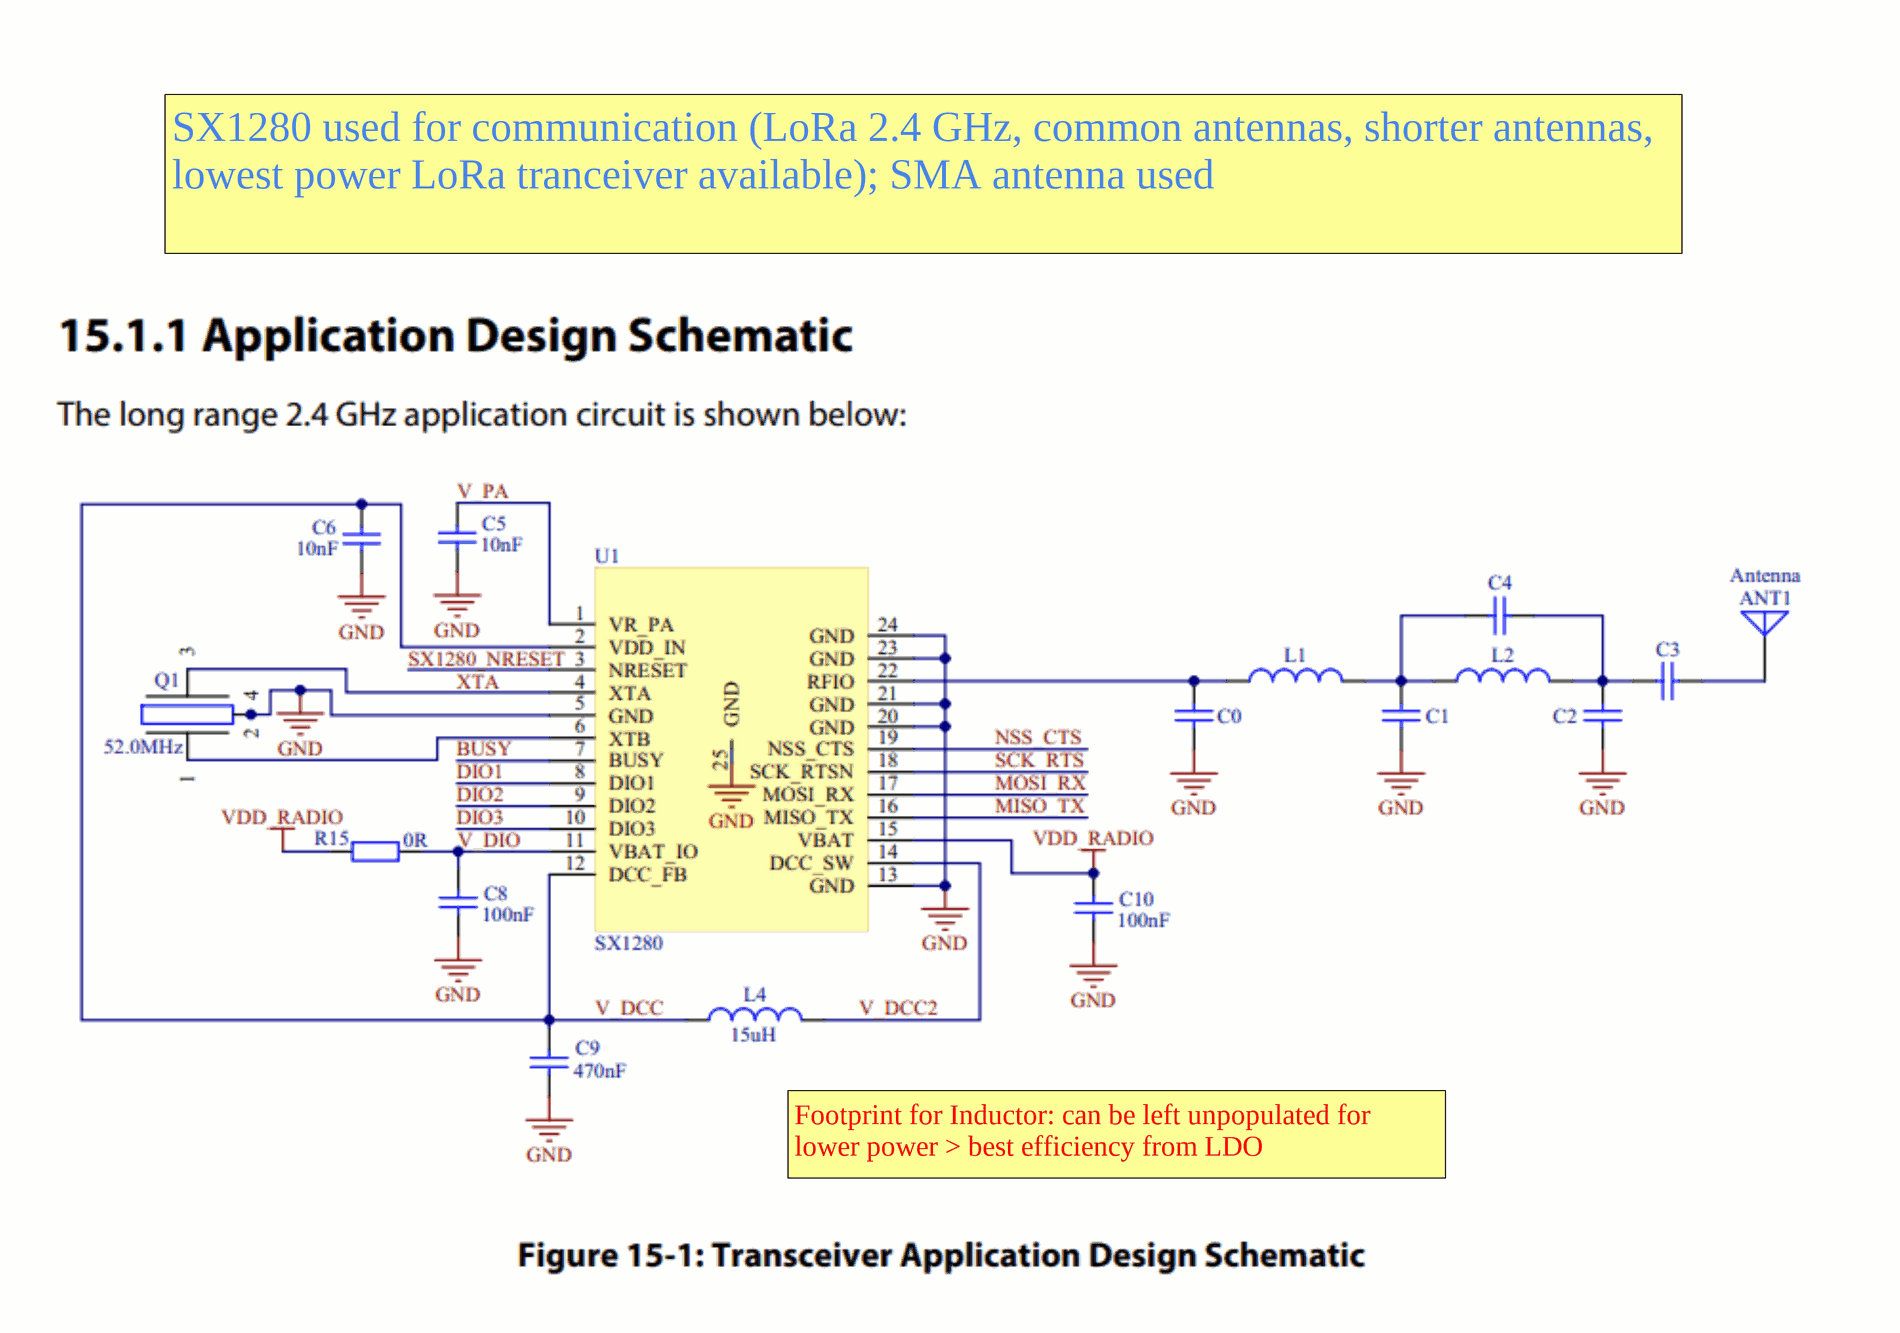
[diagram p11: 3_Communication.SchDoc, bottom left]
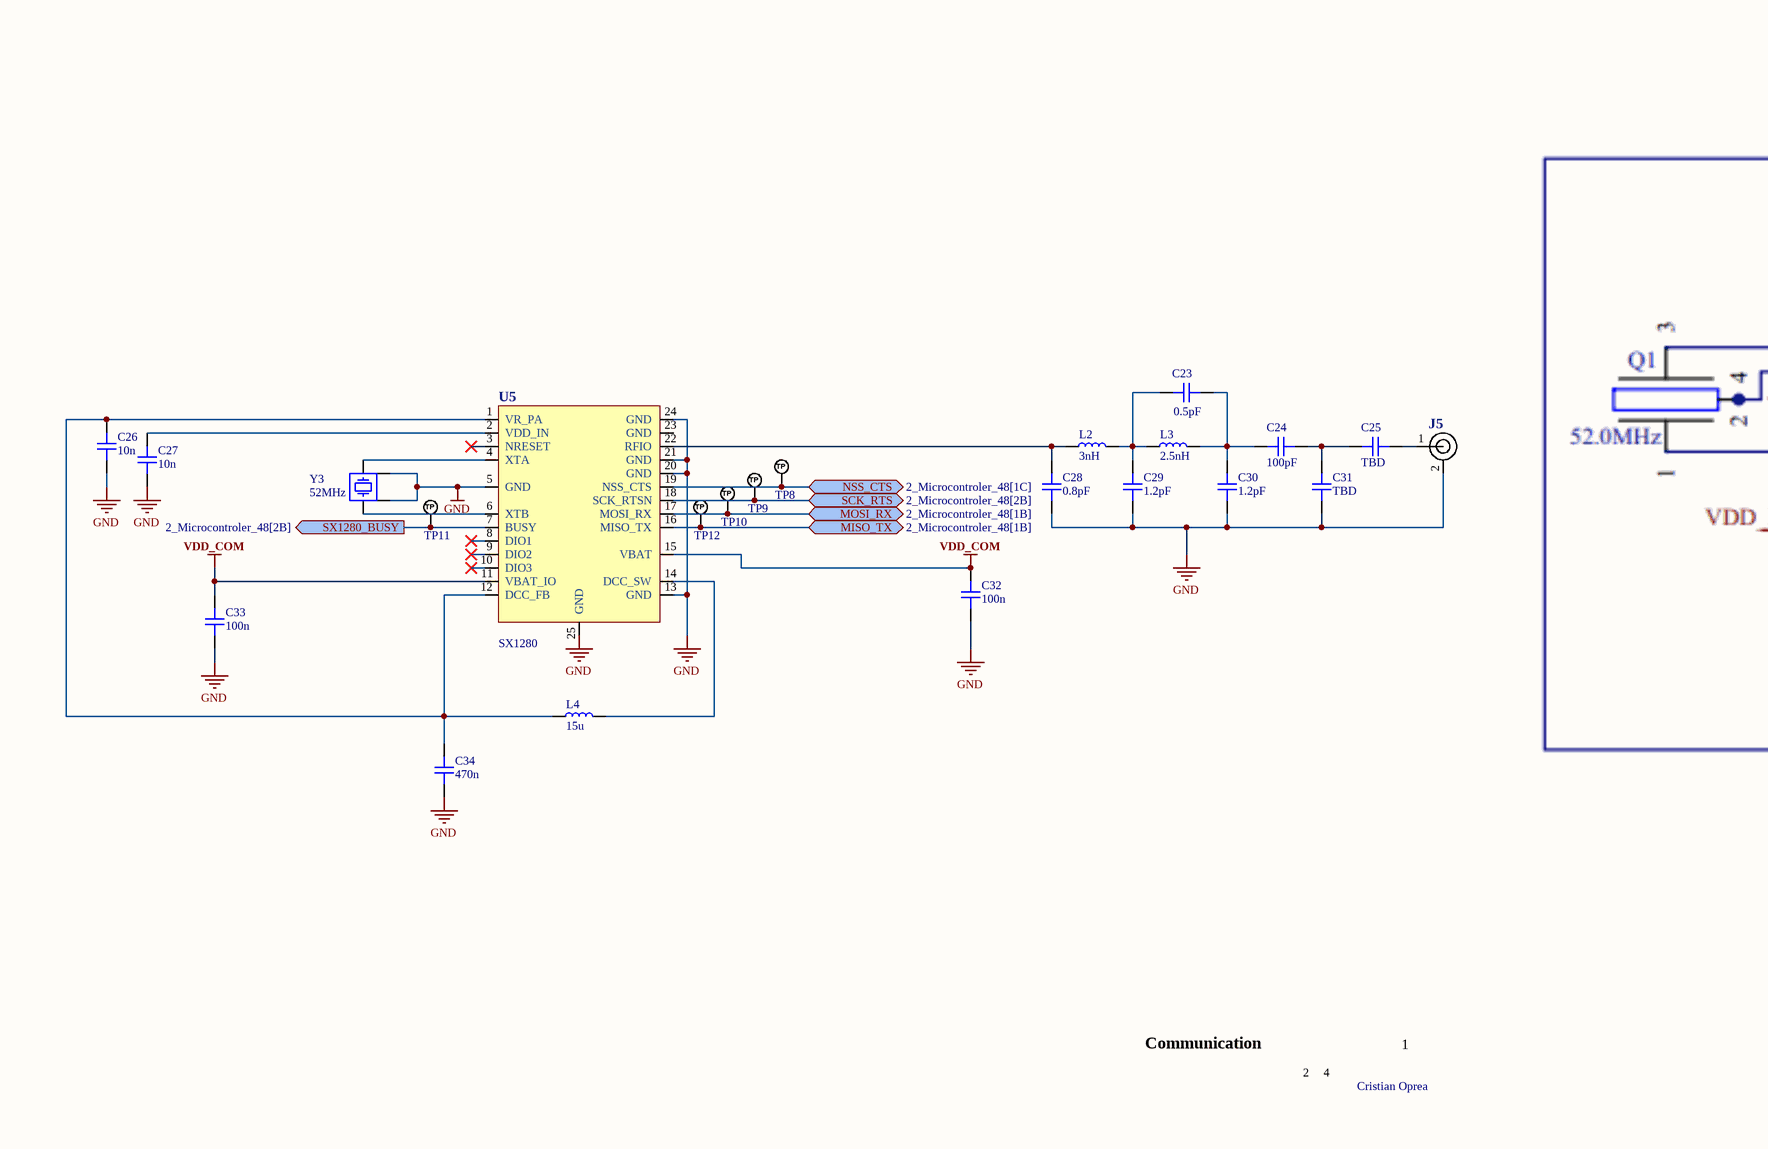
[diagram p12: 3_Communication.SchDoc, bottom middle]
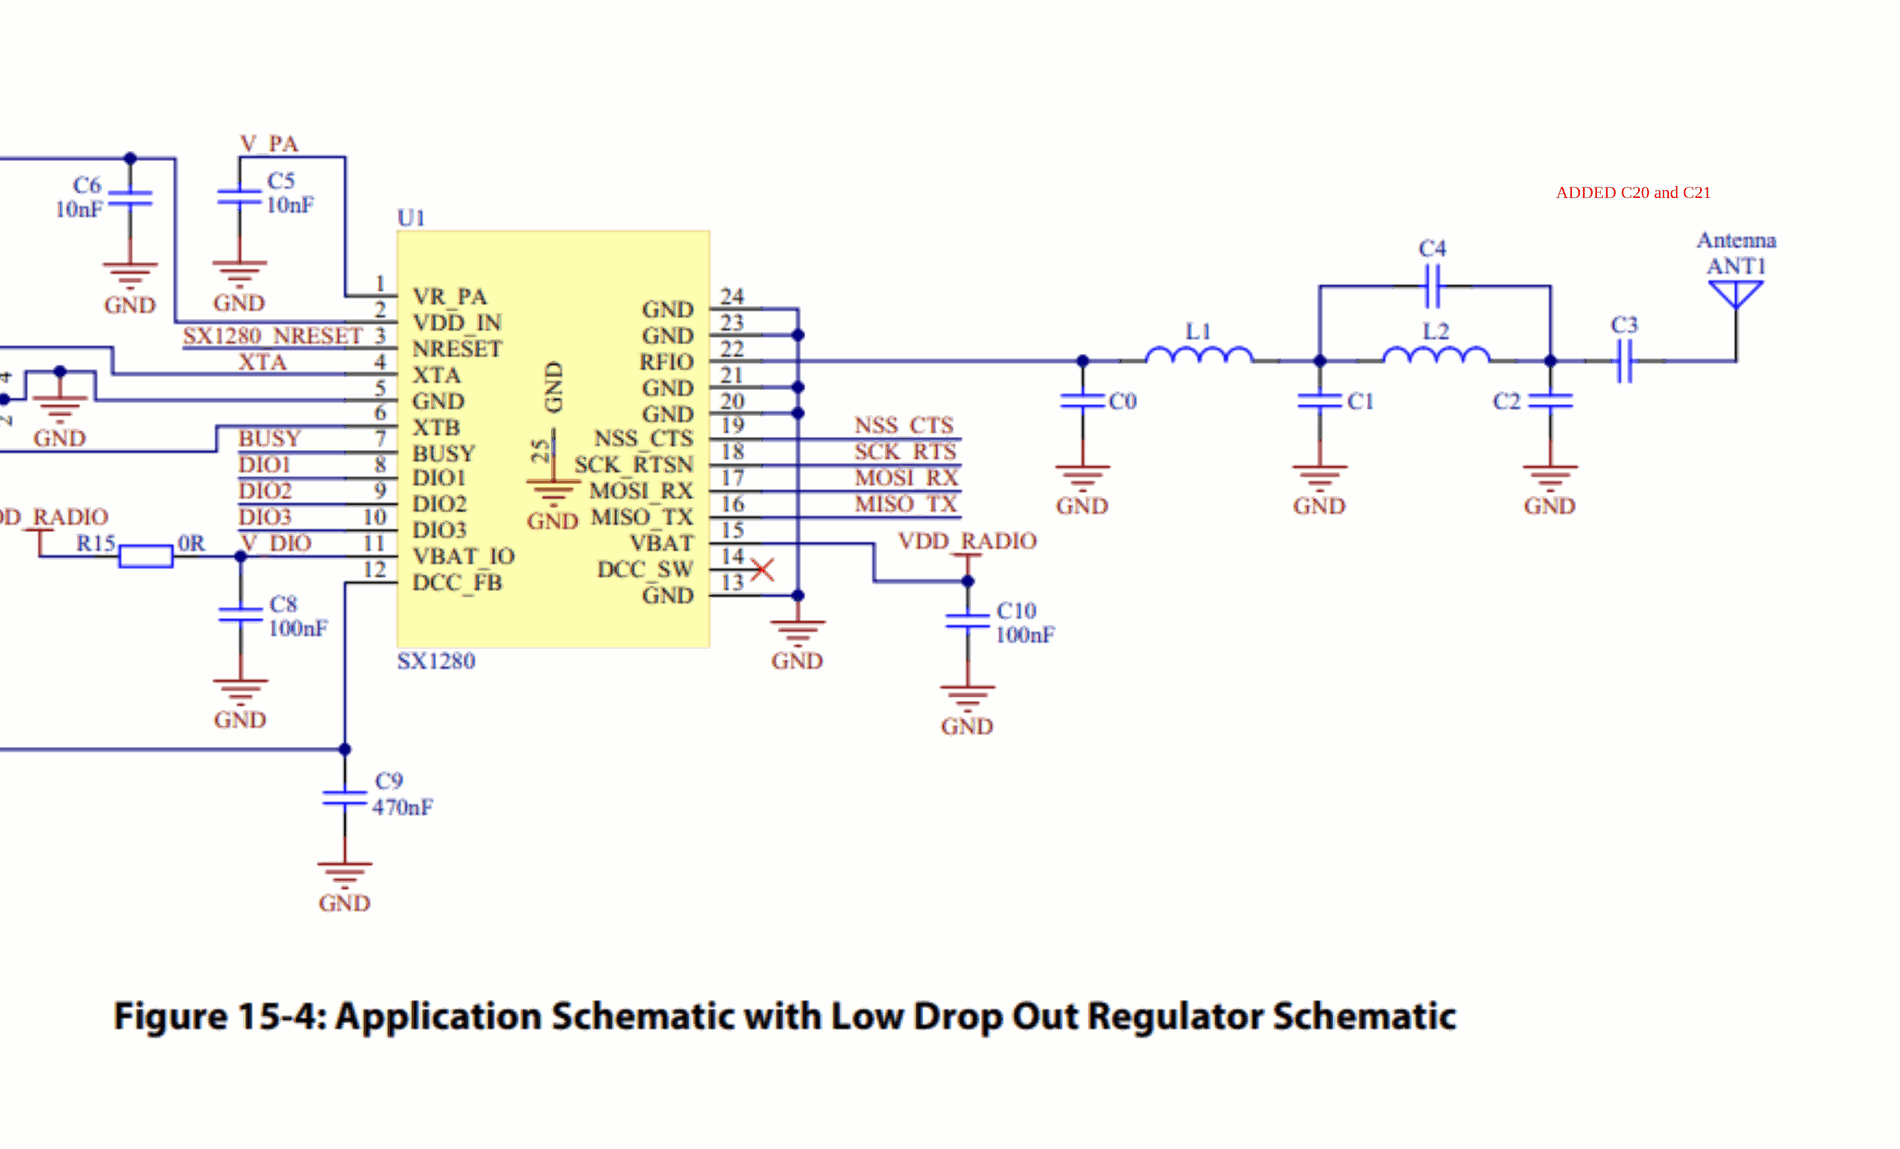
[diagram p13: 3_Communication.SchDoc, bottom right]

### Parts
C23  0.5pF  [C0603]
C24  100pF  [C0603]
C25  TBD  [C0805]
C26  10n  [C0603]
C27  10n  [C0603]
C28  0.8pF  [C0603]
C29  1.2pF  [C0603]
C30  1.2pF  [C0603]
C31  TBD  [C0805]
C32  100n  [C0603]
C33  100n  [C0603]
C34  470n  [C0603]
J5  SMA_EDGE_CONN  [CON_SMA-EDGE-S]  (value not drawn)
L2  3nH  [R0603]
L3  2.5nH  [R0603]
L4  15u  [IND_3.2_4]
TP8  TP_NOBOM  [TEST_PAD_THD]  (value not drawn)  (no BOM)
TP9  TP_NOBOM  [TEST_PAD_THD]  (value not drawn)  (no BOM)
TP10  TP_NOBOM  [TEST_PAD_THD]  (value not drawn)  (no BOM)
TP11  TP_NOBOM  [TEST_PAD_THD]  (value not drawn)  (no BOM)
TP12  TP_NOBOM  [TEST_PAD_THD]  (value not drawn)  (no BOM)
U5  SX1280  [QFN-24_4x4_0.5]
Y3  52MHz  [CRYSTAL_2016_4P]

### Ports
MISO_TX (bidir, see 2_Microcontroler_48[1B]), MOSI_RX (bidir, see 2_Microcontroler_48[1B]), NSS_CTS (bidir, see 2_Microcontroler_48[1C]), SCK_RTS (bidir, see 2_Microcontroler_48[2B]), SX1280_BUSY (out, see 2_Microcontroler_48[2B])

### Nets
GND: C26.1 C27.1 C28.1 C29.1 C30.1 C31.1 C32.1 C33.1 C34.1 J5.2 U5.5(GND) U5.13(GND) U5.20(GND) U5.21(GND) U5.24(GND) U5.25(GND) Y3.2 Y3.4
VDD_COM: C32.2 C33.2 U5.11(VBAT_IO) U5.15(VBAT)
NetC23_1: C23.1 C24.2 C30.2 L3.2
NetC23_2: C23.2 C29.2 L2.2 L3.1
NetC24_1: C24.1 C25.2 C31.2
NetC25_1: C25.1 J5.1
NetC26_2: C26.2 C34.2 L4.1 U5.1(VR_PA) U5.12(DCC_FB)
NetC27_2: C27.2 U5.2(VDD_IN)
NetC28_2: C28.2 L2.1 U5.22(RFIO)
NetL4_2: L4.2 U5.14(DCC_SW)
NetTP8_1: TP8.1(TP) U5.19(NSS_CTS) ; port NSS_CTS
NetTP9_1: TP9.1(TP) U5.18(SCK_RTSN) ; port SCK_RTS
NetTP10_1: TP10.1(TP) U5.17(MOSI_RX) ; port MOSI_RX
NetTP11_1: TP11.1(TP) U5.7(BUSY) ; port SX1280_BUSY
NetTP12_1: TP12.1(TP) U5.16(MISO_TX) ; port MISO_TX
NetU5_4: U5.4(XTA) Y3.3
NetU5_6: U5.6(XTB) Y3.1

Not connected (* = marked no-connect by the designer): U5 3(NRESET)* 8(DIO1)* 9(DIO2)* 10(DIO3)* 23(GND)

### Notes on the sheet
- SX1280 used for communication (LoRa 2.4 GHz, common antennas, shorter antennas, lowest power LoRa tranceiver available); SMA antenna used
- ADDED C20 and C21
- impedance matching configurations(40R to 50R after C25)
- (near J5) Values based on antenna input impedance; capacitors to ground can be left unpopullated, inductors or series capacitors can be swaped with 0R resistors or shunts
- (near J5) last 2 capacitors are for impedance matching for certain antenna
- Footprint for Inductor: can be left unpopulated for lower power > best efficiency from LDO
- Communication
- 2
- 4
- 1
- Cristian Oprea

### Library data of the parts
C23 C24 C26 C27 C29 C30 C32-C34 = CAP_0603: Capacitor SMD 0603; Manufacturer: *; Manufacturer Part Number: *; Distributor Link: *; LCSC: *; Rating: *; Dielectric: *
C25 C31 = CAP_0603: Capacitor SMD 0805; Manufacturer: *; Manufacturer Part Number: *; Distributor Link: *; LCSC: *; Rating: *; Dielectric: *
C28 = CAP_0805: Capacitor SMD 0805; Manufacturer: *; Manufacturer Part Number: *; Distributor Link: *; LCSC: *; Rating: *; Dielectric: *
J5 = CON-SMA-EDGE-S: RF Connector SMA Female 50 Ohms 18 GHz PCB Edge Mount; Manufacturer: RF Solutions; Manufacturer Part Number: CON-SMA-EDGE-S
L2-L4 = IND_0603: Inductor SMD 0603
TP8-TP12 = TEST_POINT_RND_1MM: Test Point Round 1mm (NO BOM)
U5 = SX1280: Low power LoRa transceiver operating at 2.4GHz with ranging capability
Y3 = Crystal: as Y2 on sheet 2_Microcontroler_48

## Sheet 4_Expansion.SchDoc
size A4; SheetNumber: 4; SheetTotal: 4
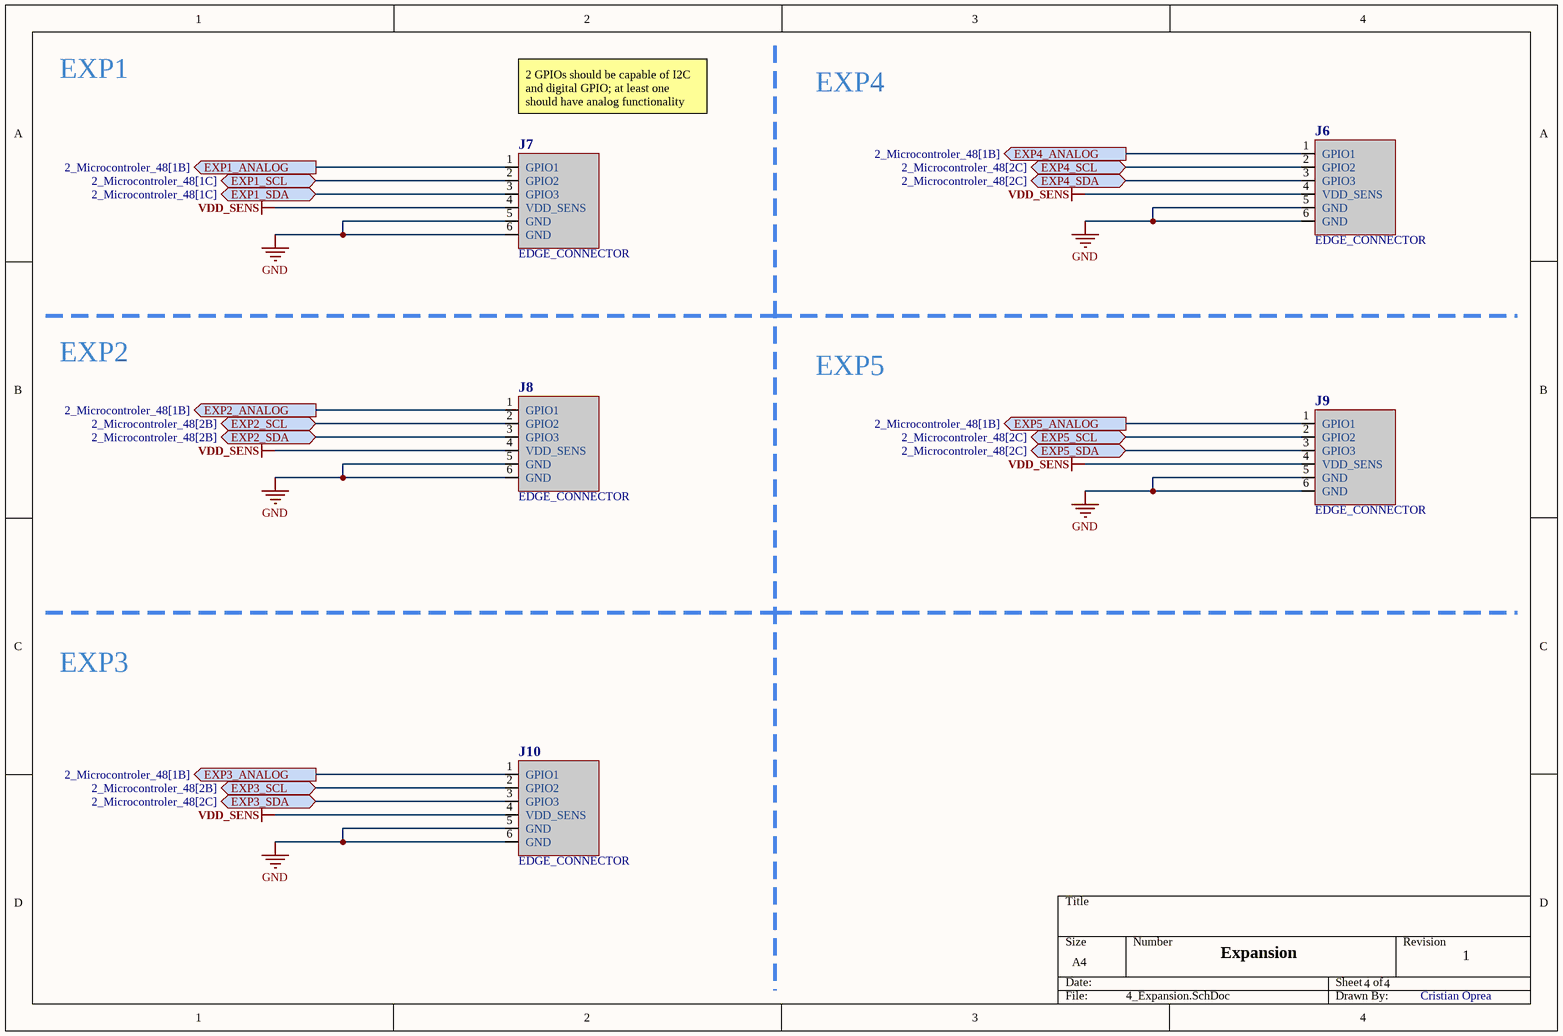
[diagram p14: 4_Expansion.SchDoc]

### Parts
J6  EDGE_CONNECTOR  [2.54mm_edge_connector]
J7  EDGE_CONNECTOR  [2.54mm_edge_connector]
J8  EDGE_CONNECTOR  [2.54mm_edge_connector]
J9  EDGE_CONNECTOR  [2.54mm_edge_connector]
J10  EDGE_CONNECTOR  [2.54mm_edge_connector]

### Ports
EXP1_ANALOG (out, see 2_Microcontroler_48[1B]), EXP1_SCL (bidir, see 2_Microcontroler_48[1C]), EXP1_SDA (bidir, see 2_Microcontroler_48[1C]), EXP2_ANALOG (out, see 2_Microcontroler_48[1B]), EXP2_SCL (bidir, see 2_Microcontroler_48[2B]), EXP2_SDA (bidir, see 2_Microcontroler_48[2B]), EXP3_ANALOG (out, see 2_Microcontroler_48[1B]), EXP3_SCL (bidir, see 2_Microcontroler_48[2B]), EXP3_SDA (bidir, see 2_Microcontroler_48[2C]), EXP4_ANALOG (out, see 2_Microcontroler_48[1B]), EXP4_SCL (bidir, see 2_Microcontroler_48[2C]), EXP4_SDA (bidir, see 2_Microcontroler_48[2C]), EXP5_ANALOG (out, see 2_Microcontroler_48[1B]), EXP5_SCL (bidir, see 2_Microcontroler_48[2C]), EXP5_SDA (bidir, see 2_Microcontroler_48[2C])

### Nets
GND: J6.5(GND) J6.6(GND) J7.5(GND) J7.6(GND) J8.5(GND) J8.6(GND) J9.5(GND) J9.6(GND) J10.5(GND) J10.6(GND)
VDD_SENS: J6.4(VDD_SENS) J7.4(VDD_SENS) J8.4(VDD_SENS) J9.4(VDD_SENS) J10.4(VDD_SENS)
NetJ6_1: J6.1(GPIO1) ; port EXP4_ANALOG
NetJ6_2: J6.2(GPIO2) ; port EXP4_SCL
NetJ6_3: J6.3(GPIO3) ; port EXP4_SDA
NetJ7_1: J7.1(GPIO1) ; port EXP1_ANALOG
NetJ7_2: J7.2(GPIO2) ; port EXP1_SCL
NetJ7_3: J7.3(GPIO3) ; port EXP1_SDA
NetJ8_1: J8.1(GPIO1) ; port EXP2_ANALOG
NetJ8_2: J8.2(GPIO2) ; port EXP2_SCL
NetJ8_3: J8.3(GPIO3) ; port EXP2_SDA
NetJ9_1: J9.1(GPIO1) ; port EXP5_ANALOG
NetJ9_2: J9.2(GPIO2) ; port EXP5_SCL
NetJ9_3: J9.3(GPIO3) ; port EXP5_SDA
NetJ10_1: J10.1(GPIO1) ; port EXP3_ANALOG
NetJ10_2: J10.2(GPIO2) ; port EXP3_SCL
NetJ10_3: J10.3(GPIO3) ; port EXP3_SDA

### Notes on the sheet
- EXP1
- 2 GPIOs should be capable of I2C and digital GPIO; at least one should have analog functionality
- EXP4
- EXP2
- EXP5
- EXP3
- Expansion
- 4
- 1
- Cristian Oprea

### Library data of the parts
J6-J10 = edge_connector: Connector for sensor modules

## Nets that join several sheets
GND: 1_Power (22 pins), 2_Microcontroler_48 (30 pins), 3_Communication (18 pins), 4_Expansion (10 pins)
VDD: 1_Power (5 pins), 2_Microcontroler_48 (12 pins)
VDD_COM: 1_Power (TP2.1 U2.5 U2.6), 3_Communication (C32.2 C33.2 U5.11 U5.15)
VDD_SENS: 1_Power (C9.2 TP3.1 U3.5 U3.6), 4_Expansion (5 pins)
NetJ6_1: 2_Microcontroler_48 (U4.14), 4_Expansion (J6.1)
NetJ6_2: 2_Microcontroler_48 (U4.21), 4_Expansion (J6.2)
NetJ6_3: 2_Microcontroler_48 (U4.22), 4_Expansion (J6.3)
NetJ7_1: 2_Microcontroler_48 (U4.10), 4_Expansion (J7.1)
NetJ7_2: 2_Microcontroler_48 (U4.30), 4_Expansion (J7.2)
NetJ7_3: 2_Microcontroler_48 (U4.31), 4_Expansion (J7.3)
NetJ8_1: 2_Microcontroler_48 (U4.11), 4_Expansion (J8.1)
NetJ8_2: 2_Microcontroler_48 (U4.42), 4_Expansion (J8.2)
NetJ8_3: 2_Microcontroler_48 (U4.43), 4_Expansion (J8.3)
NetJ9_1: 2_Microcontroler_48 (U4.15), 4_Expansion (J9.1)
NetJ9_2: 2_Microcontroler_48 (U4.26), 4_Expansion (J9.2)
NetJ9_3: 2_Microcontroler_48 (U4.27), 4_Expansion (J9.3)
NetJ10_1: 2_Microcontroler_48 (U4.13), 4_Expansion (J10.1)
NetJ10_2: 2_Microcontroler_48 (U4.45), 4_Expansion (J10.2)
NetJ10_3: 2_Microcontroler_48 (U4.46), 4_Expansion (J10.3)
NetTP1_1: 1_Power (TP1.1 U1.11), 2_Microcontroler_48 (U4.20)
NetTP4_1: 1_Power (U1.22), 2_Microcontroler_48 (TP4.1 U4.19)
NetTP6_1: 1_Power (U2.3), 2_Microcontroler_48 (TP6.1 U4.29)
NetTP7_1: 1_Power (U3.3), 2_Microcontroler_48 (TP7.1 U4.28)
NetTP8_1: 2_Microcontroler_48 (U4.38), 3_Communication (TP8.1 U5.19)
NetTP9_1: 2_Microcontroler_48 (U4.39), 3_Communication (TP9.1 U5.18)
NetTP10_1: 2_Microcontroler_48 (U4.17), 3_Communication (TP10.1 U5.17)
NetTP11_1: 2_Microcontroler_48 (U4.18), 3_Communication (TP11.1 U5.7)
NetTP12_1: 2_Microcontroler_48 (U4.16), 3_Communication (TP12.1 U5.16)